# Altium schematic sheet CONTROLLER.SchDoc (part 1 of 2)
size A0
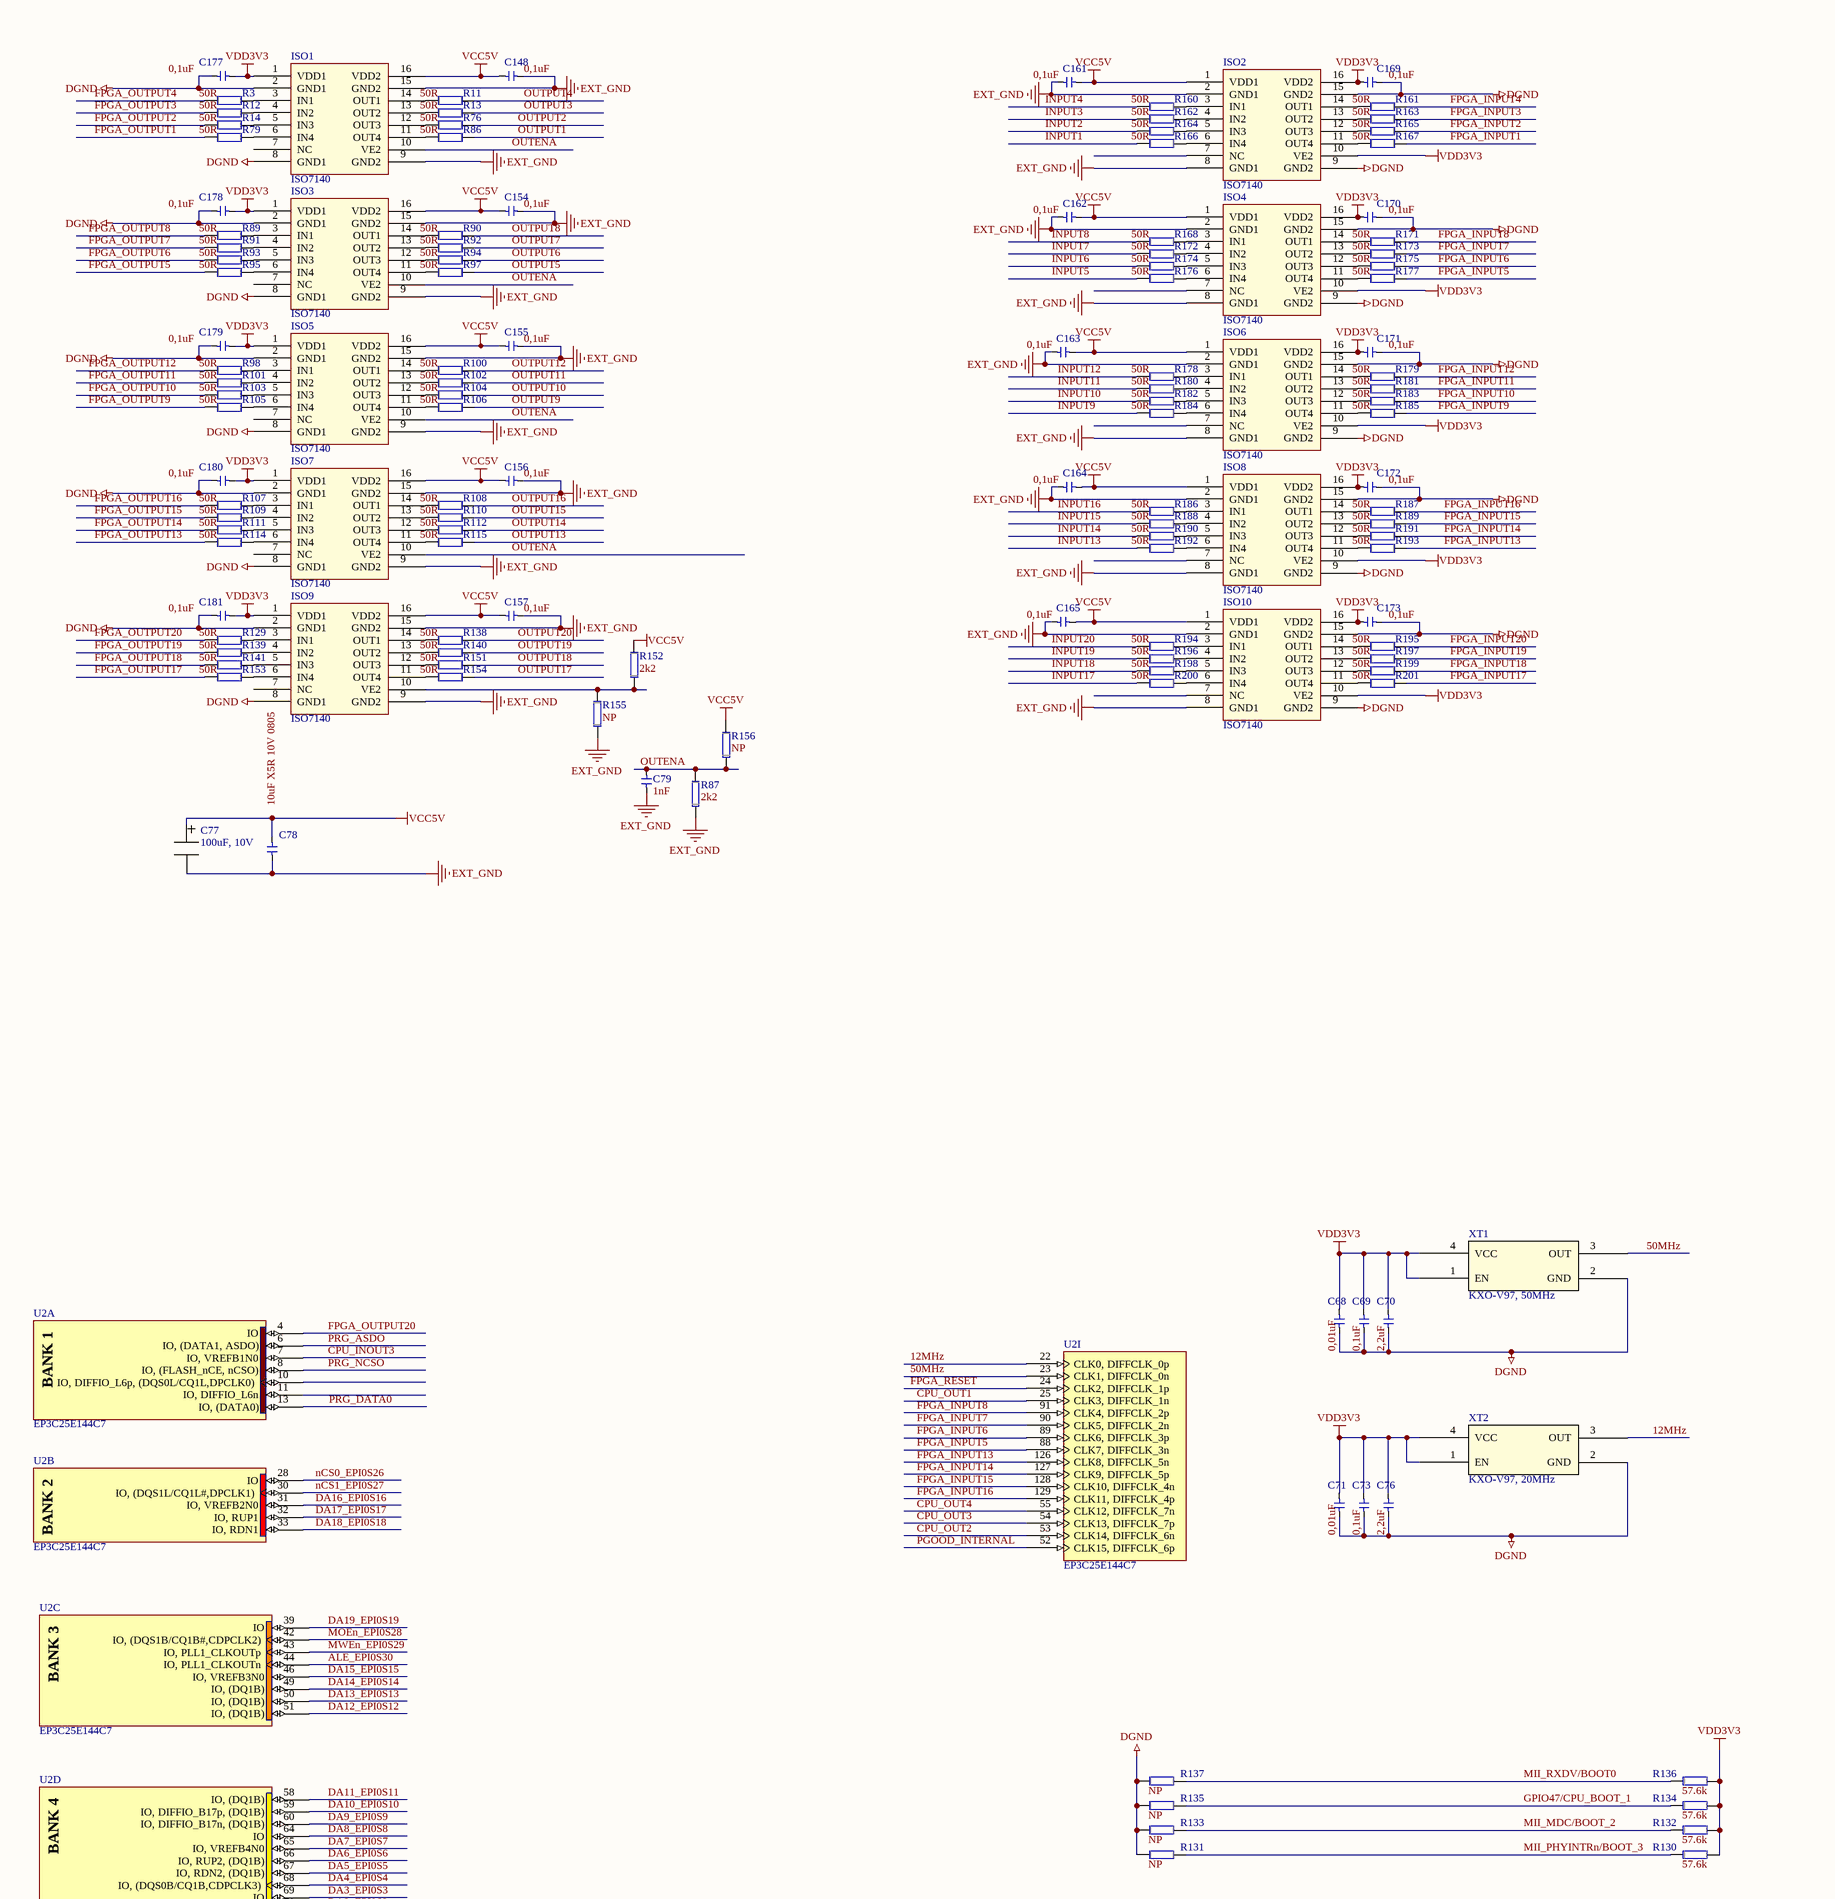
[diagram p0: CONTROLLER.SchDoc, top left]
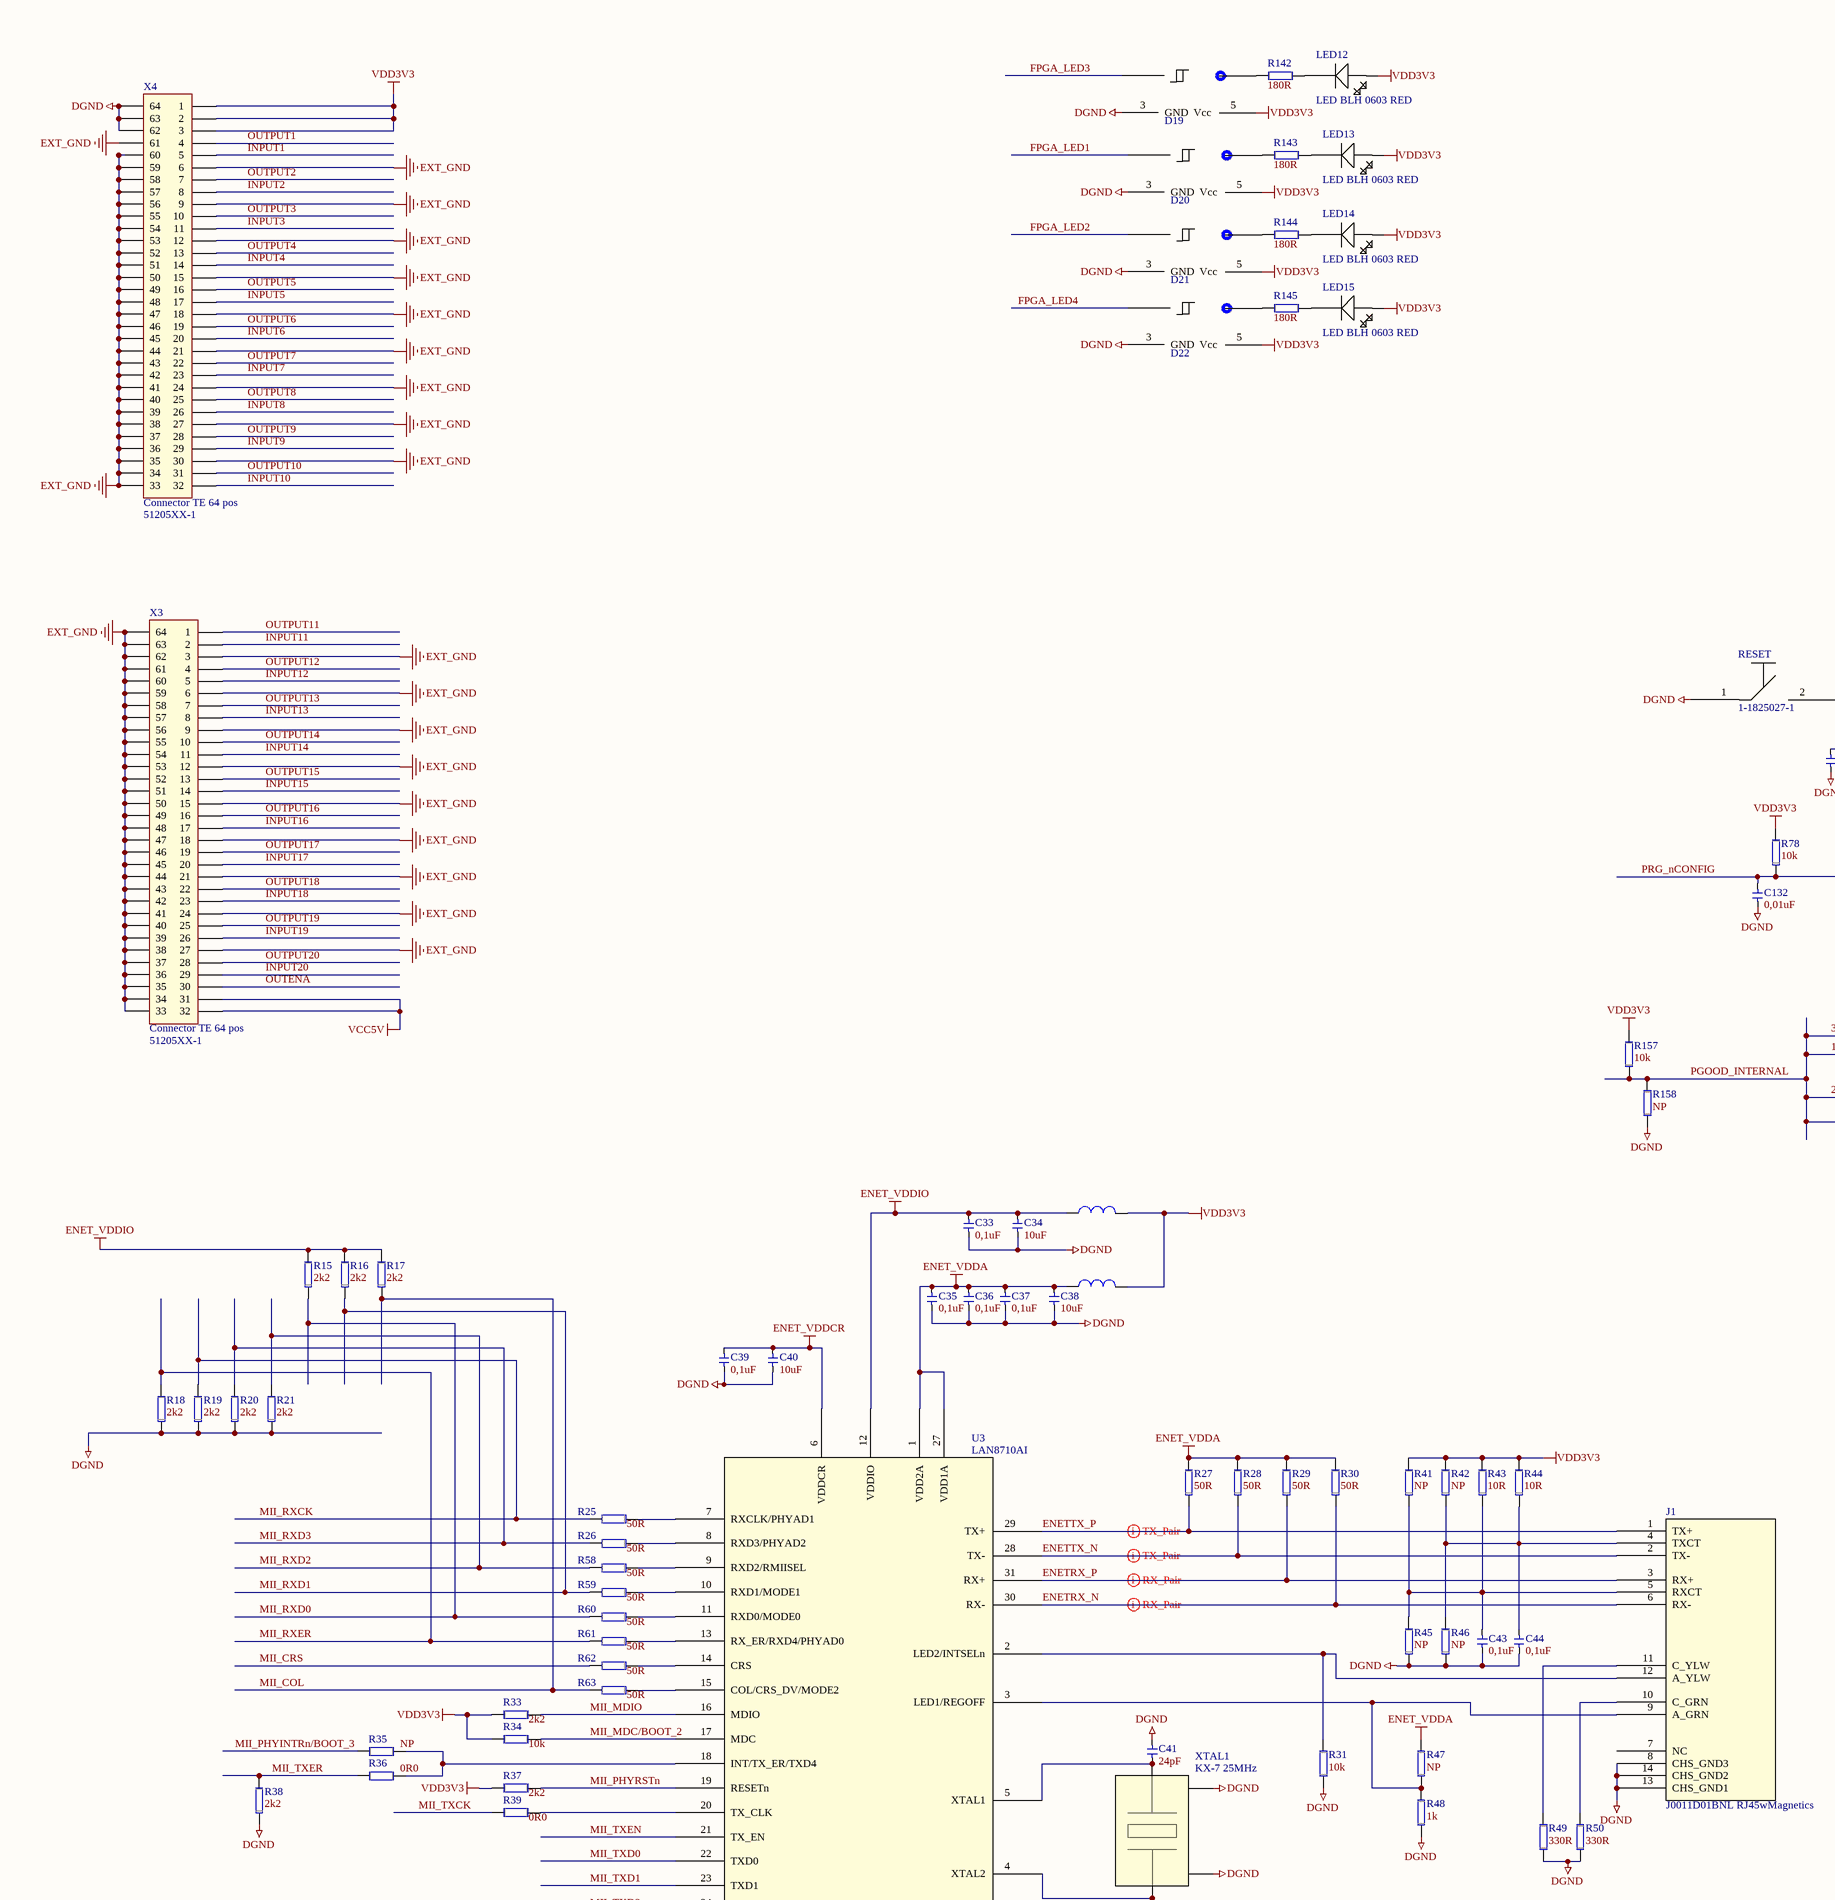
[diagram p1: CONTROLLER.SchDoc, top middle]
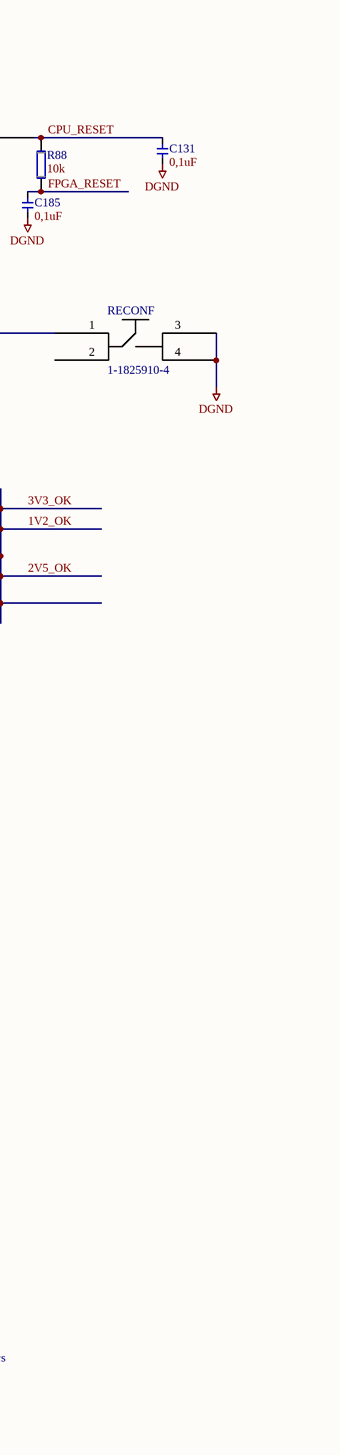
[diagram p2: CONTROLLER.SchDoc, top right]
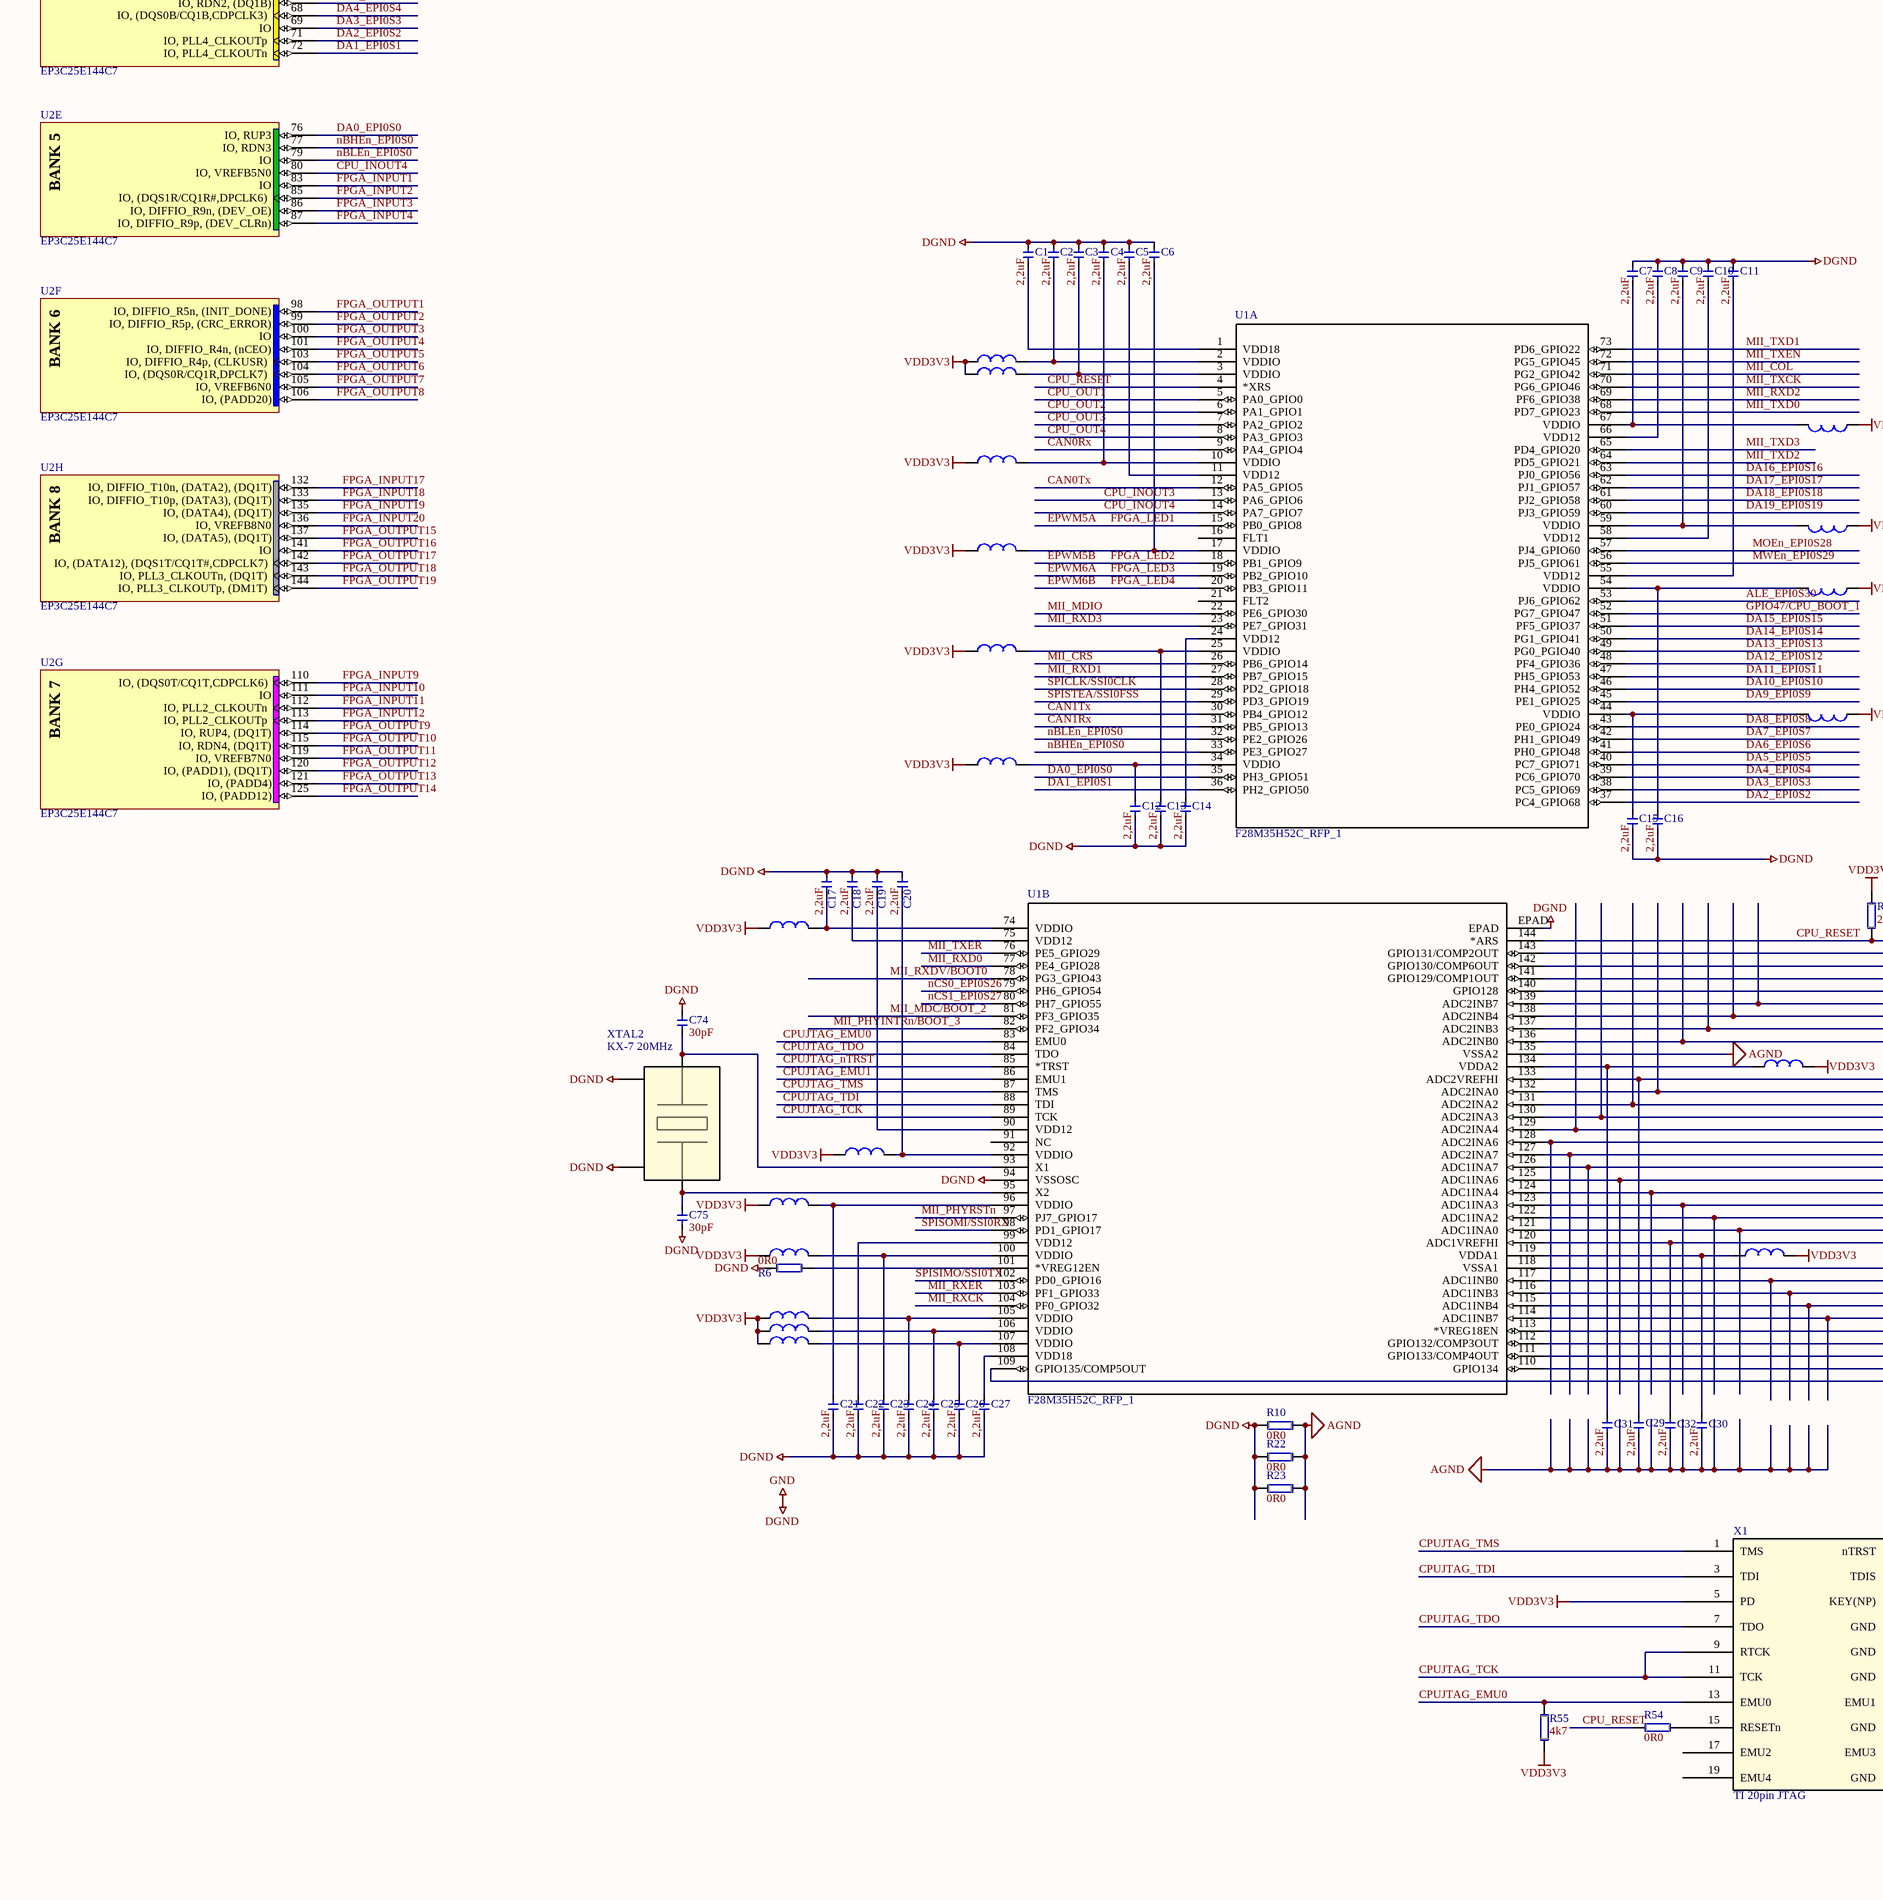
[diagram p3: CONTROLLER.SchDoc, bottom left]
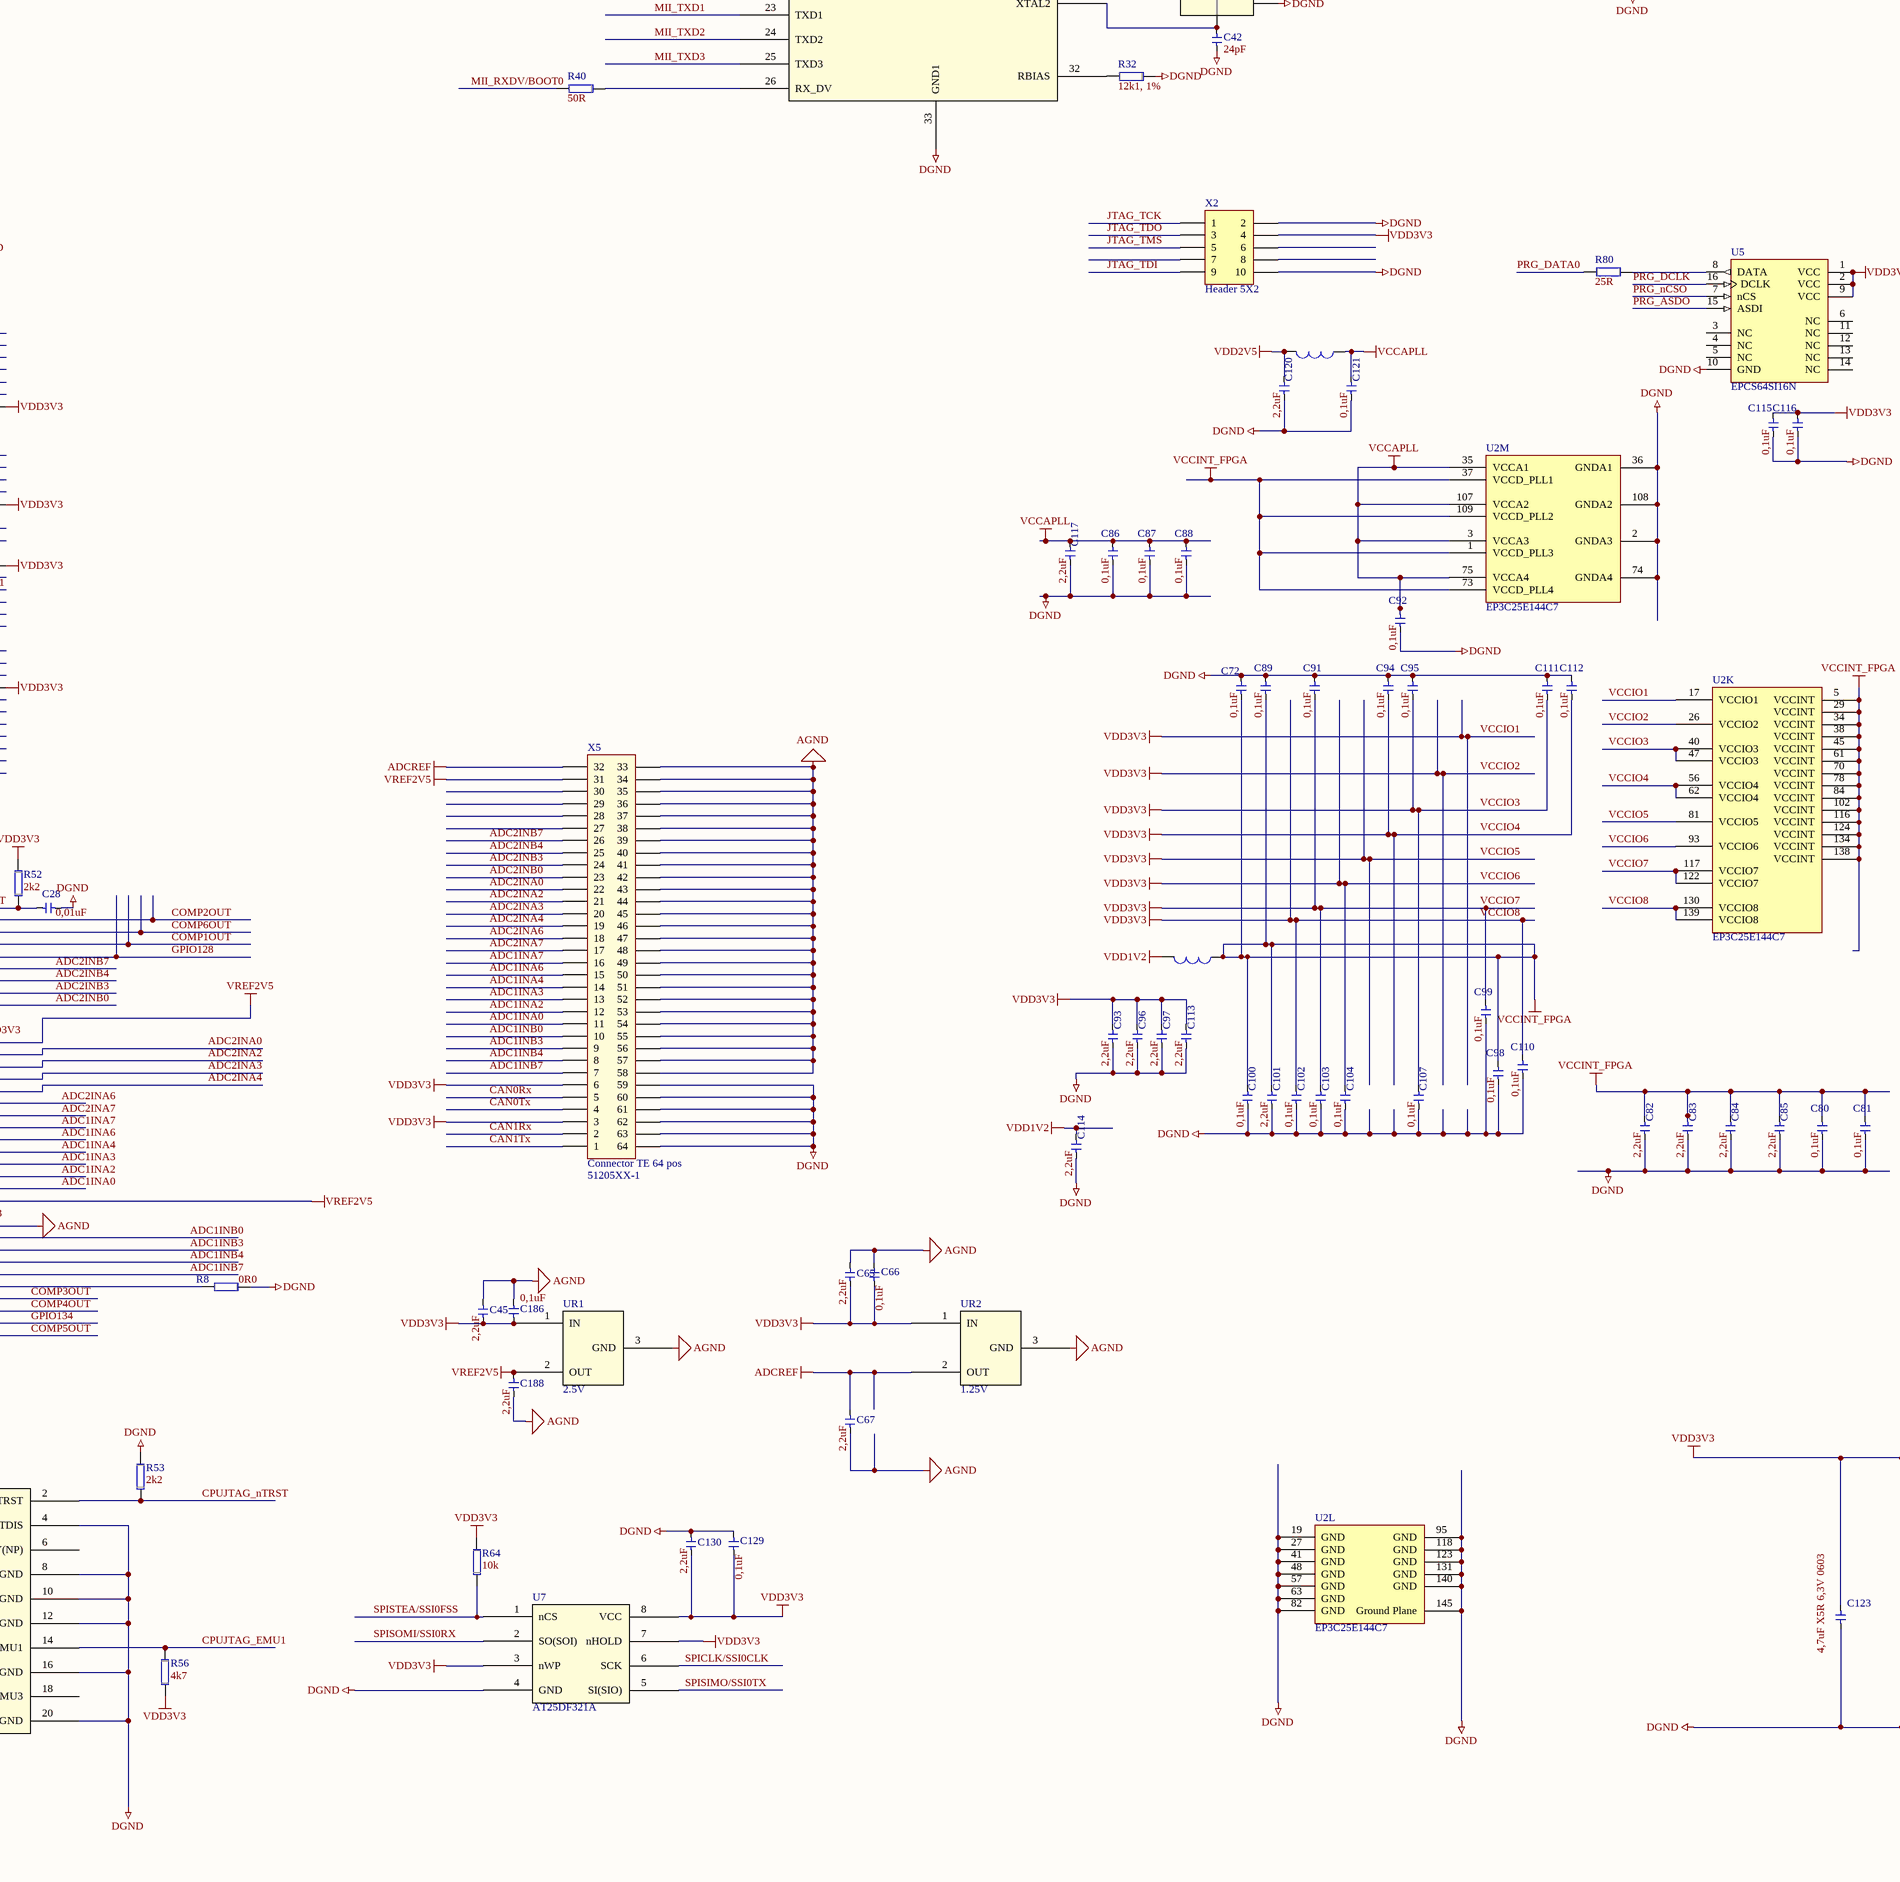
[diagram p4: CONTROLLER.SchDoc, bottom middle]
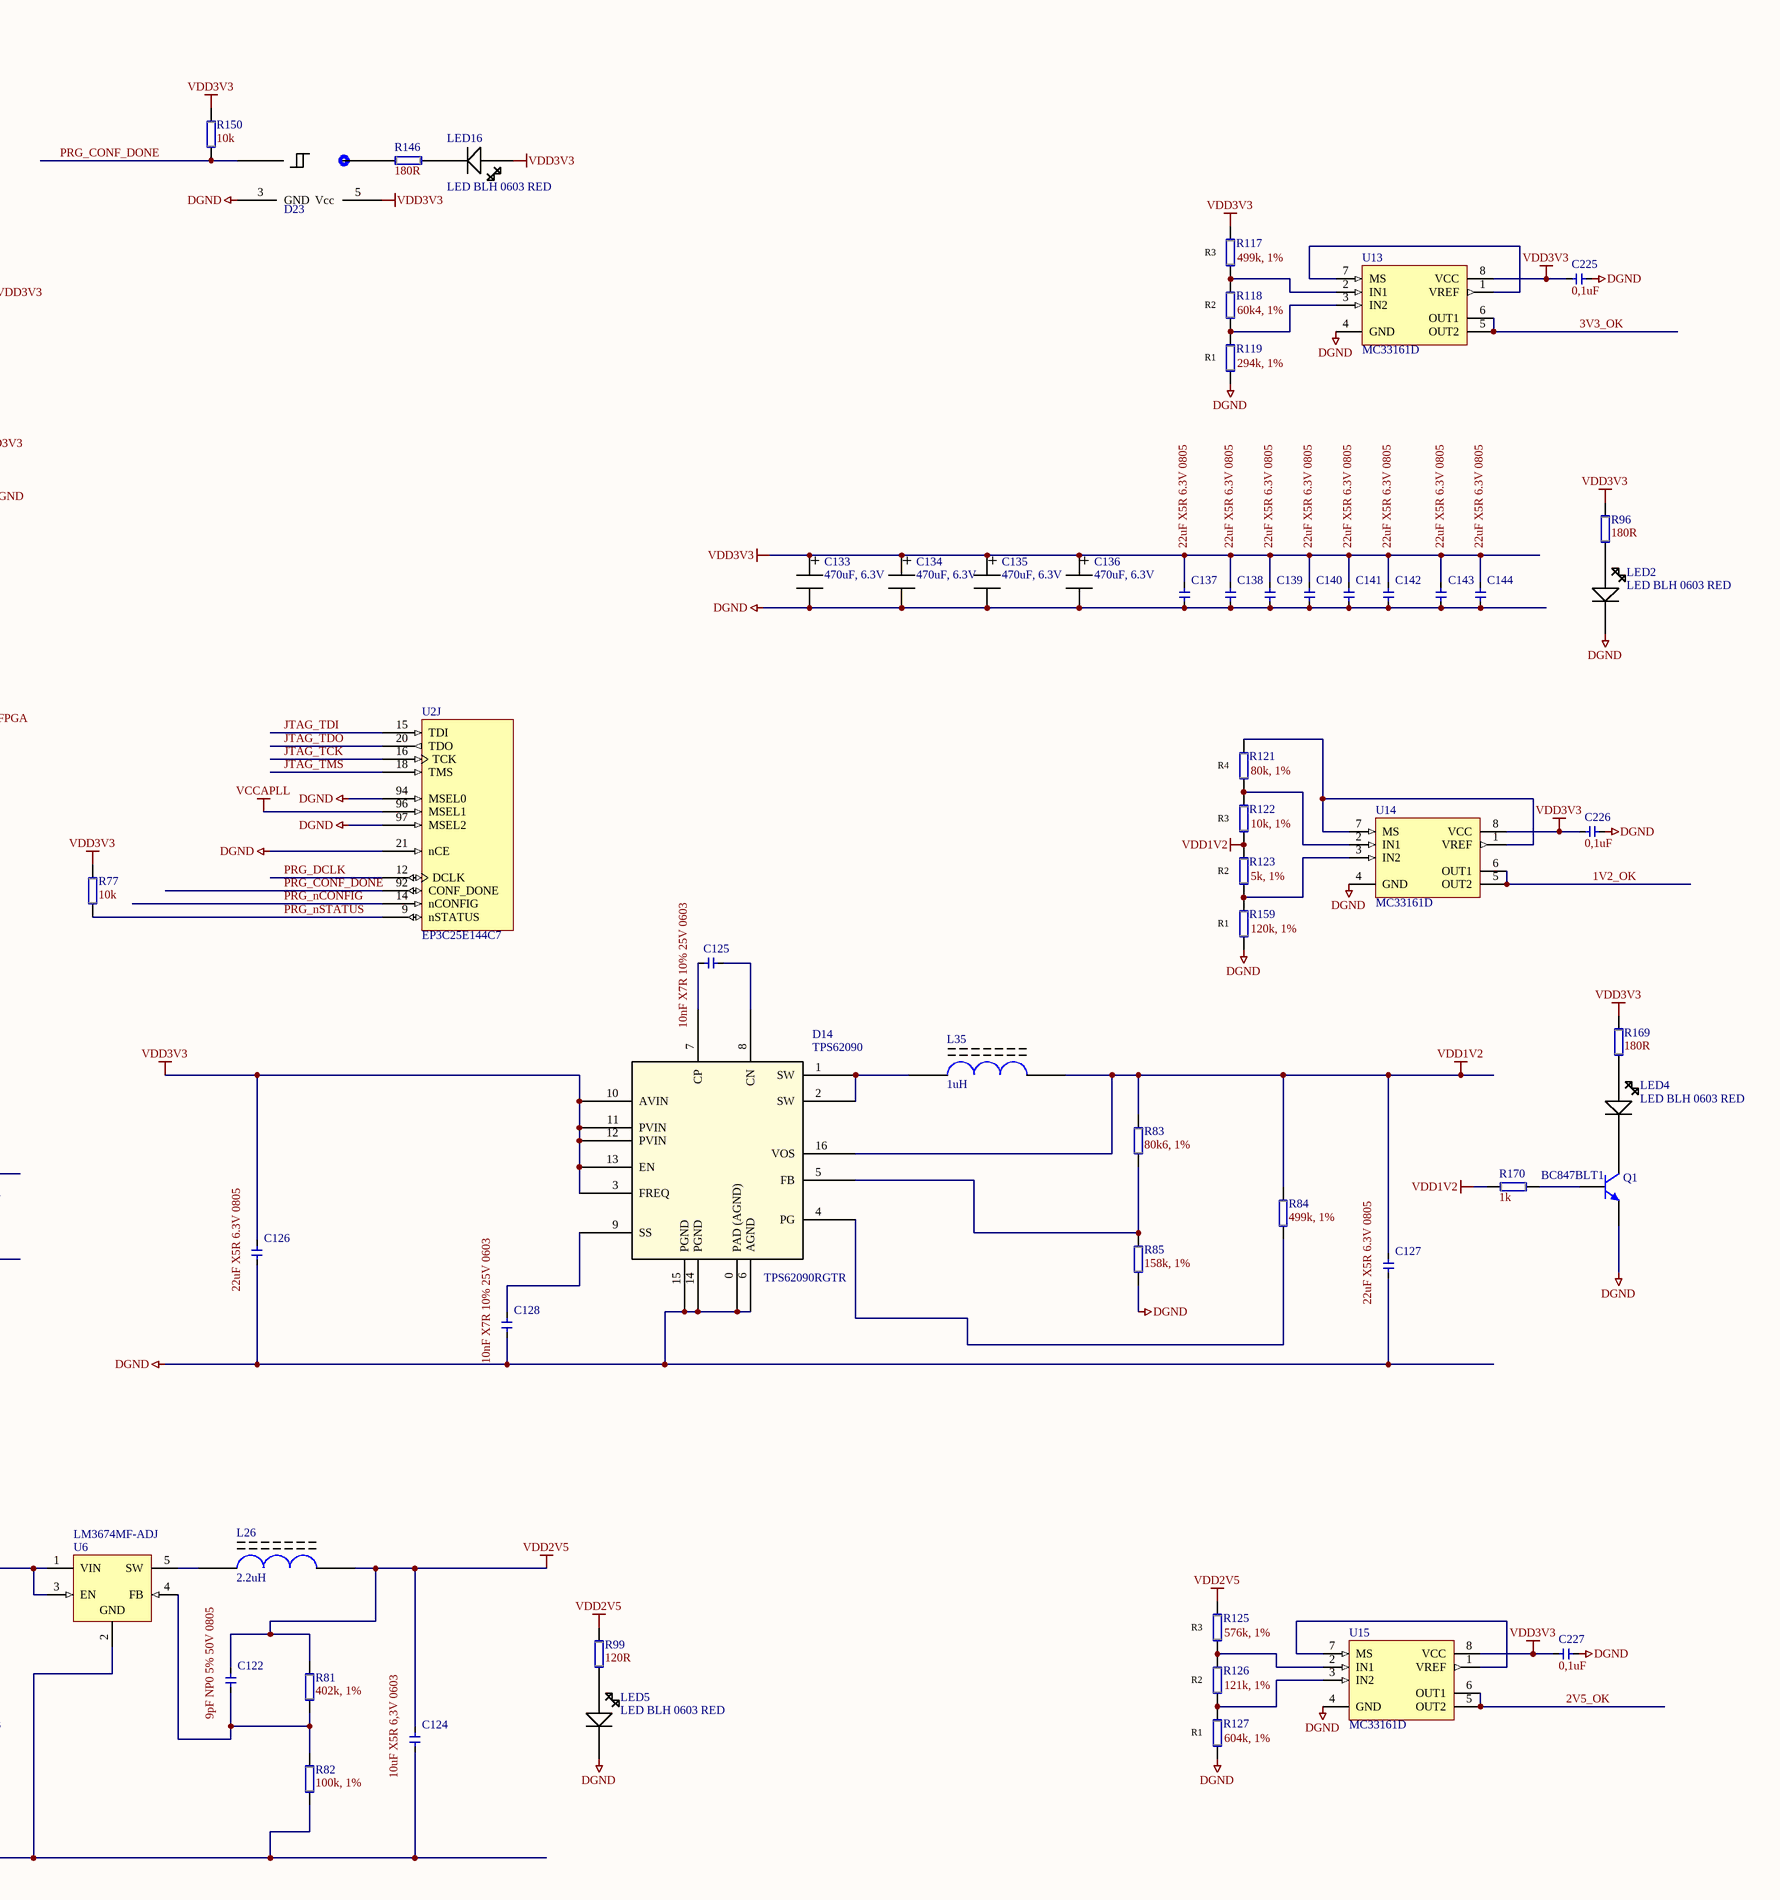
[diagram p5: CONTROLLER.SchDoc, bottom right]

## Parts
C1  value 2,2uF  [SMD CAP 0603]  (hidden comment: ChipCap)
C2  value 2,2uF  [SMD CAP 0603]  (hidden comment: ChipCap)
C3  value 2,2uF  [SMD CAP 0603]  (hidden comment: ChipCap)
C4  value 2,2uF  [SMD CAP 0603]  (hidden comment: ChipCap)
C5  value 2,2uF  [SMD CAP 0603]  (hidden comment: ChipCap)
C6  value 2,2uF  [SMD CAP 0603]  (hidden comment: ChipCap)
C7  value 2,2uF  [SMD CAP 0603]  (hidden comment: ChipCap)
C8  value 2,2uF  [SMD CAP 0603]  (hidden comment: ChipCap)
C9  value 2,2uF  [SMD CAP 0603]  (hidden comment: ChipCap)
C10  value 2,2uF  [SMD CAP 0603]  (hidden comment: ChipCap)
C11  value 2,2uF  [SMD CAP 0603]  (hidden comment: ChipCap)
C12  value 2,2uF  [SMD CAP 0603]  (hidden comment: ChipCap)
C13  value 2,2uF  [SMD CAP 0603]  (hidden comment: ChipCap)
C14  value 2,2uF  [SMD CAP 0603]  (hidden comment: ChipCap)
C15  value 2,2uF  [SMD CAP 0603]  (hidden comment: ChipCap)
C16  value 2,2uF  [SMD CAP 0603]  (hidden comment: ChipCap)
C17  value 2,2uF  [SMD CAP 0603]  (hidden comment: ChipCap)
C18  value 2,2uF  [SMD CAP 0603]  (hidden comment: ChipCap)
C19  value 2,2uF  [SMD CAP 0603]  (hidden comment: ChipCap)
C20  value 2,2uF  [SMD CAP 0603]  (hidden comment: ChipCap)
C21  value 2,2uF  [SMD CAP 0603]  (hidden comment: ChipCap)
C22  value 2,2uF  [SMD CAP 0603]  (hidden comment: ChipCap)
C23  value 2,2uF  [SMD CAP 0603]  (hidden comment: ChipCap)
C24  value 2,2uF  [SMD CAP 0603]  (hidden comment: ChipCap)
C25  value 2,2uF  [SMD CAP 0603]  (hidden comment: ChipCap)
C26  value 2,2uF  [SMD CAP 0603]  (hidden comment: ChipCap)
C27  value 2,2uF  [SMD CAP 0603]  (hidden comment: ChipCap)
C28  value 0,01uF  [SMD CAP 0603]  (hidden comment: ChipCap)
C29  value 2,2uF  [SMD CAP 0603]  (hidden comment: ChipCap)
C30  value 2,2uF  [SMD CAP 0603]  (hidden comment: ChipCap)
C31  value 2,2uF  [SMD CAP 0603]  (hidden comment: ChipCap)
C32  value 2,2uF  [SMD CAP 0603]  (hidden comment: ChipCap)
C33  value 0,1uF  [SMD CAP 0603]  (hidden comment: ChipCap)
C34  value 10uF  [SMD CAP 0805]  (hidden comment: ChipCap)
C35  value 0,1uF  [SMD CAP 0603]  (hidden comment: ChipCap)
C36  value 0,1uF  [SMD CAP 0603]  (hidden comment: ChipCap)
C37  value 0,1uF  [SMD CAP 0603]  (hidden comment: ChipCap)
C38  value 10uF  [SMD CAP 0805]  (hidden comment: ChipCap)
C39  value 0,1uF  [SMD CAP 0603]  (hidden comment: ChipCap)
C40  value 10uF  [SMD CAP 0805]  (hidden comment: ChipCap)
C41  value 24pF  [SMD CAP 0603]  (hidden comment: ChipCap)
C42  value 24pF  [SMD CAP 0603]  (hidden comment: ChipCap)
C43  value 0,1uF  [SMD CAP 0603]  (hidden comment: ChipCap)
C44  value 0,1uF  [SMD CAP 0603]  (hidden comment: ChipCap)
C45  value 2,2uF  [SMD CAP 0603]  (hidden comment: ChipCap)
C65  value 2,2uF  [SMD CAP 0603]  (hidden comment: ChipCap)
C66  value 0,1uF  [SMD CAP 0603]  (hidden comment: ChipCap)
C67  value 2,2uF  [SMD CAP 0603]  (hidden comment: ChipCap)
C68  value 0,01uF  [SMD CAP 0603]  (hidden comment: ChipCap)
C69  value 0,1uF  [SMD CAP 0603]  (hidden comment: ChipCap)
C70  value 2,2uF  [SMD CAP 0603]  (hidden comment: ChipCap)
C71  value 0,01uF  [SMD CAP 0603]  (hidden comment: ChipCap)
C72  value 0,1uF  [SMD CAP 0603]  (hidden comment: ChipCap)
C73  value 0,1uF  [SMD CAP 0603]  (hidden comment: ChipCap)
C74  value 30pF  [SMD CAP 0603]  (hidden comment: ChipCap)
C75  value 30pF  [SMD CAP 0603]  (hidden comment: ChipCap)
C76  value 2,2uF  [SMD CAP 0603]  (hidden comment: ChipCap)
C77  value 100uF, 10V  [D]  (hidden comment: Tant Cap D-case)
C78  value 10uF X5R 10V 0805  [SMD CAP 0805]  (hidden comment: ChipCap)
C79  value 1nF  [SMD CAP 0603]  (hidden comment: ChipCap)
C80  value 0,1uF  [SMD CAP 0603]  (hidden comment: ChipCap)
C81  value 0,1uF  [SMD CAP 0603]  (hidden comment: ChipCap)
C82  value 2,2uF  [SMD CAP 0603]  (hidden comment: ChipCap)
C83  value 2,2uF  [SMD CAP 0603]  (hidden comment: ChipCap)
C84  value 2,2uF  [SMD CAP 0603]  (hidden comment: ChipCap)
C85  value 2,2uF  [SMD CAP 0603]  (hidden comment: ChipCap)
C86  value 0,1uF  [SMD CAP 0603]  (hidden comment: ChipCap)
C87  value 0,1uF  [SMD CAP 0603]  (hidden comment: ChipCap)
C88  value 0,1uF  [SMD CAP 0603]  (hidden comment: ChipCap)
C89  value 0,1uF  [SMD CAP 0603]  (hidden comment: ChipCap)
C91  value 0,1uF  [SMD CAP 0603]  (hidden comment: ChipCap)
C92  value 0,1uF  [SMD CAP 0603]  (hidden comment: ChipCap)
C93  value 2,2uF  [SMD CAP 0603]  (hidden comment: ChipCap)
C94  value 0,1uF  [SMD CAP 0603]  (hidden comment: ChipCap)
C95  value 0,1uF  [SMD CAP 0603]  (hidden comment: ChipCap)
C96  value 2,2uF  [SMD CAP 0603]  (hidden comment: ChipCap)
C97  value 2,2uF  [SMD CAP 0603]  (hidden comment: ChipCap)
C98  value 0,1uF  [SMD CAP 0603]  (hidden comment: ChipCap)
C99  value 0,1uF  [SMD CAP 0603]  (hidden comment: ChipCap)
C100  value 0,1uF  [SMD CAP 0603]  (hidden comment: ChipCap)
C101  value 2,2uF  [SMD CAP 0603]  (hidden comment: ChipCap)
C102  value 0,1uF  [SMD CAP 0603]  (hidden comment: ChipCap)
C103  value 0,1uF  [SMD CAP 0603]  (hidden comment: ChipCap)
C104  value 0,1uF  [SMD CAP 0603]  (hidden comment: ChipCap)
C107  value 0,1uF  [SMD CAP 0603]  (hidden comment: ChipCap)
C110  value 0,1uF  [SMD CAP 0603]  (hidden comment: ChipCap)
C111  value 0,1uF  [SMD CAP 0603]  (hidden comment: ChipCap)
C112  value 0,1uF  [SMD CAP 0603]  (hidden comment: ChipCap)
C113  value 2,2uF  [SMD CAP 0603]  (hidden comment: ChipCap)
C114  value 2,2uF  [SMD CAP 0603]  (hidden comment: ChipCap)
C115  value 0,1uF  [SMD CAP 0603]  (hidden comment: ChipCap)
C116  value 0,1uF  [SMD CAP 0603]  (hidden comment: ChipCap)
C117  value 2,2uF  [SMD CAP 0603]  (hidden comment: ChipCap)
C120  value 2,2uF  [SMD CAP 0603]  (hidden comment: ChipCap)
C121  value 0,1uF  [SMD CAP 0603]  (hidden comment: ChipCap)
C122  value 9pF NP0 5% 50V 0805  [SMD CAP 0805]  (hidden comment: ChipCap)
C123  value 4,7uF X5R 6,3V 0603  [SMD CAP 0603]  (hidden comment: ChipCap)
C124  value 10uF X5R 6,3V 0603  [SMD CAP 0603]  (hidden comment: ChipCap)
C125  value 10nF X7R 10% 25V 0603  [SMD CAP 0603]  (hidden comment: ChipCap)
C126  value 22uF X5R 6.3V 0805  [SMD CAP 0805]  (hidden comment: ChipCap)
C127  value 22uF X5R 6.3V 0805  [SMD CAP 0805]  (hidden comment: ChipCap)
C128  value 10nF X7R 10% 25V 0603  [SMD CAP 0603]  (hidden comment: ChipCap)
C129  value 0,1uF  [SMD CAP 0603]  (hidden comment: ChipCap)
C130  value 2,2uF  [SMD CAP 0603]  (hidden comment: ChipCap)
C131  value 0,1uF  [SMD CAP 0603]  (hidden comment: ChipCap)
C132  value 0,01uF  [SMD CAP 0603]  (hidden comment: ChipCap)
C133  value 470uF, 6.3V  [D]  (hidden comment: Tant Cap D-case)
C134  value 470uF, 6.3V  [D]  (hidden comment: Tant Cap D-case)
C135  value 470uF, 6.3V  [D]  (hidden comment: Tant Cap D-case)
C136  value 470uF, 6.3V  [D]  (hidden comment: Tant Cap D-case)
C137  value 22uF X5R 6.3V 0805  [SMD CAP 0805]  (hidden comment: ChipCap)
C138  value 22uF X5R 6.3V 0805  [SMD CAP 0805]  (hidden comment: ChipCap)
C139  value 22uF X5R 6.3V 0805  [SMD CAP 0805]  (hidden comment: ChipCap)
C140  value 22uF X5R 6.3V 0805  [SMD CAP 0805]  (hidden comment: ChipCap)
C141  value 22uF X5R 6.3V 0805  [SMD CAP 0805]  (hidden comment: ChipCap)
C142  value 22uF X5R 6.3V 0805  [SMD CAP 0805]  (hidden comment: ChipCap)
C143  value 22uF X5R 6.3V 0805  [SMD CAP 0805]  (hidden comment: ChipCap)
C144  value 22uF X5R 6.3V 0805  [SMD CAP 0805]  (hidden comment: ChipCap)
C148  value 0,1uF  [SMD CAP 0603]  (hidden comment: ChipCap)
C154  value 0,1uF  [SMD CAP 0603]  (hidden comment: ChipCap)
C155  value 0,1uF  [SMD CAP 0603]  (hidden comment: ChipCap)
C156  value 0,1uF  [SMD CAP 0603]  (hidden comment: ChipCap)
C157  value 0,1uF  [SMD CAP 0603]  (hidden comment: ChipCap)
C161  value 0,1uF  [SMD CAP 0603]  (hidden comment: ChipCap)
C162  value 0,1uF  [SMD CAP 0603]  (hidden comment: ChipCap)
C163  value 0,1uF  [SMD CAP 0603]  (hidden comment: ChipCap)
C164  value 0,1uF  [SMD CAP 0603]  (hidden comment: ChipCap)
C165  value 0,1uF  [SMD CAP 0603]  (hidden comment: ChipCap)
C169  value 0,1uF  [SMD CAP 0603]  (hidden comment: ChipCap)
C170  value 0,1uF  [SMD CAP 0603]  (hidden comment: ChipCap)
C171  value 0,1uF  [SMD CAP 0603]  (hidden comment: ChipCap)
C172  value 0,1uF  [SMD CAP 0603]  (hidden comment: ChipCap)
C173  value 0,1uF  [SMD CAP 0603]  (hidden comment: ChipCap)
C177  value 0,1uF  [SMD CAP 0603]  (hidden comment: ChipCap)
C178  value 0,1uF  [SMD CAP 0603]  (hidden comment: ChipCap)
C179  value 0,1uF  [SMD CAP 0603]  (hidden comment: ChipCap)
C180  value 0,1uF  [SMD CAP 0603]  (hidden comment: ChipCap)
C181  value 0,1uF  [SMD CAP 0603]  (hidden comment: ChipCap)
C185  value 0,1uF  [SMD CAP 0603]  (hidden comment: ChipCap)
C186  value 0,1uF  [SMD CAP 0603]  (hidden comment: ChipCap)
C188  value 2,2uF  [SMD CAP 0603]  (hidden comment: ChipCap)
C225  value 0,1uF  [SMD CAP 0603]  (hidden comment: ChipCap)
C226  value 0,1uF  [SMD CAP 0603]  (hidden comment: ChipCap)
C227  value 0,1uF  [SMD CAP 0603]  (hidden comment: ChipCap)
D14  TPS62090  value TPS62090RGTR  [QFN50P300X300X100-16N]
D19  Inverted Schmitt Trigger  [TI-SOT23 SOT95P280X145-5N]  (value not drawn)
D20  Inverted Schmitt Trigger  [TI-SOT23 SOT95P280X145-5N]  (value not drawn)
D21  Inverted Schmitt Trigger  [TI-SOT23 SOT95P280X145-5N]  (value not drawn)
D22  Inverted Schmitt Trigger  [TI-SOT23 SOT95P280X145-5N]  (value not drawn)
D23  Inverted Schmitt Trigger  [TI-SOT23 SOT95P280X145-5N]  (value not drawn)
ISO1  value ISO7140  [DBQ016]  (hidden comment: ISO7140 Isolator)
ISO2  value ISO7140  [DBQ016]  (hidden comment: ISO7140 Isolator)
ISO3  value ISO7140  [DBQ016]  (hidden comment: ISO7140 Isolator)
ISO4  value ISO7140  [DBQ016]  (hidden comment: ISO7140 Isolator)
ISO5  value ISO7140  [DBQ016]  (hidden comment: ISO7140 Isolator)
ISO6  value ISO7140  [DBQ016]  (hidden comment: ISO7140 Isolator)
ISO7  value ISO7140  [DBQ016]  (hidden comment: ISO7140 Isolator)
ISO8  value ISO7140  [DBQ016]  (hidden comment: ISO7140 Isolator)
ISO9  value ISO7140  [DBQ016]  (hidden comment: ISO7140 Isolator)
ISO10  value ISO7140  [DBQ016]  (hidden comment: ISO7140 Isolator)
J1  J0011D01BNL RJ45wMagnetics  [J0011D01BNL]
L1  LQM21  [SMD IND 0805]  (value not drawn)
L2  LQM21  [SMD IND 0805]  (value not drawn)
L3  LQM21  [SMD IND 0805]  (value not drawn)
L4  LQM21  [SMD IND 0805]  (value not drawn)
L5  LQM21  [SMD IND 0805]  (value not drawn)
L6  LQM21  [SMD IND 0805]  (value not drawn)
L8  LQM21  [SMD IND 0805]  (value not drawn)
L9  LQM21  [SMD IND 0805]  (value not drawn)
L10  LQM21  [SMD IND 0805]  (value not drawn)
L11  LQM21  [SMD IND 0805]  (value not drawn)
L12  LQM21  [SMD IND 0805]  (value not drawn)
L13  LQM21  [SMD IND 0805]  (value not drawn)
L14  LQM21  [SMD IND 0805]  (value not drawn)
L15  LQM21  [SMD IND 0805]  (value not drawn)
L16  LQM21  [SMD IND 0805]  (value not drawn)
L17  LQM21  [SMD IND 0805]  (value not drawn)
L18  LQM21  [SMD IND 0805]  (value not drawn)
L19  LQM21  [SMD IND 0805]  (value not drawn)
L20  LQM21  [SMD IND 0805]  (value not drawn)
L21  LQM21  [SMD IND 0805]  (value not drawn)
L22  LQM21  [SMD IND 0805]  (value not drawn)
L25  LQM21  [SMD IND 0805]  (value not drawn)
L26  value 2.2uH  [CDRH2D14 IND]  (hidden comment: CDRH2D14)
L35  value 1uH  [INDC6363X50N LQH66S]  (hidden comment: LQH66S)
L36  LQM21  [SMD IND 0805]  (value not drawn)
LED2  value LED BLH 0603 RED  [1206 LED]  (hidden comment: LED BLH)
LED4  value LED BLH 0603 RED  [1206 LED]  (hidden comment: LED BLH)
LED5  value LED BLH 0603 RED  [1206 LED]  (hidden comment: LED BLH)
LED12  value LED BLH 0603 RED  [1206 LED]  (hidden comment: LED BLH)
LED13  value LED BLH 0603 RED  [1206 LED]  (hidden comment: LED BLH)
LED14  value LED BLH 0603 RED  [1206 LED]  (hidden comment: LED BLH)
LED15  value LED BLH 0603 RED  [1206 LED]  (hidden comment: LED BLH)
LED16  value LED BLH 0603 RED  [1206 LED]  (hidden comment: LED BLH)
Q1  BC847BLT1  [318-08]
R3  value 50R  [SMD RES 0603]  (hidden comment: Rsize)
R6  value 0R0  [SMD RES 0603]  (hidden comment: Rsize)
R8  value 0R0  [SMD RES 0603]  (hidden comment: Rsize)
R10  value 0R0  [SMD RES 0603]  (hidden comment: Rsize)
R11  value 50R  [SMD RES 0603]  (hidden comment: Rsize)
R12  value 50R  [SMD RES 0603]  (hidden comment: Rsize)
R13  value 50R  [SMD RES 0603]  (hidden comment: Rsize)
R14  value 50R  [SMD RES 0603]  (hidden comment: Rsize)
R15  value 2k2  [SMD RES 0603]  (hidden comment: Rsize)
R16  value 2k2  [SMD RES 0603]  (hidden comment: Rsize)
R17  value 2k2  [SMD RES 0603]  (hidden comment: Rsize)
R18  value 2k2  [SMD RES 0603]  (hidden comment: Rsize)
R19  value 2k2  [SMD RES 0603]  (hidden comment: Rsize)
R20  value 2k2  [SMD RES 0603]  (hidden comment: Rsize)
R21  value 2k2  [SMD RES 0603]  (hidden comment: Rsize)
R22  value 0R0  [SMD RES 0603]  (hidden comment: Rsize)
R23  value 0R0  [SMD RES 0603]  (hidden comment: Rsize)
R25  value 50R  [SMD RES 0603]  (hidden comment: Rsize)
R26  value 50R  [SMD RES 0603]  (hidden comment: Rsize)
R27  value 50R  [SMD RES 0603]  (hidden comment: Rsize)
R28  value 50R  [SMD RES 0603]  (hidden comment: Rsize)
R29  value 50R  [SMD RES 0603]  (hidden comment: Rsize)
R30  value 50R  [SMD RES 0603]  (hidden comment: Rsize)
R31  value 10k  [SMD RES 0603]  (hidden comment: Rsize)
R32  value 12k1, 1%  [SMD RES 0603]  (hidden comment: Rsize)
R33  value 2k2  [SMD RES 0603]  (hidden comment: Rsize)
R34  value 10k  [SMD RES 0603]  (hidden comment: Rsize)
R35  value NP  [SMD RES 0603]  (hidden comment: Rsize)
R36  value 0R0  [SMD RES 0603]  (hidden comment: Rsize)
R37  value 2k2  [SMD RES 0603]  (hidden comment: Rsize)
R38  value 2k2  [SMD RES 0603]  (hidden comment: Rsize)
R39  value 0R0  [SMD RES 0603]  (hidden comment: Rsize)
R40  value 50R  [SMD RES 0603]  (hidden comment: Rsize)
R41  value NP  [SMD RES 0603]  (hidden comment: Rsize)
R42  value NP  [SMD RES 0603]  (hidden comment: Rsize)
R43  value 10R  [SMD RES 0603]  (hidden comment: Rsize)
R44  value 10R  [SMD RES 0603]  (hidden comment: Rsize)
R45  value NP  [SMD RES 0603]  (hidden comment: Rsize)
R46  value NP  [SMD RES 0603]  (hidden comment: Rsize)
R47  value NP  [SMD RES 0603]  (hidden comment: Rsize)
R48  value 1k  [SMD RES 0603]  (hidden comment: Rsize)
R49  value 330R  [SMD RES 0603]  (hidden comment: Rsize)
R50  value 330R  [SMD RES 0603]  (hidden comment: Rsize)
R52  value 2k2  [SMD RES 0603]  (hidden comment: Rsize)
R53  value 2k2  [SMD RES 0603]  (hidden comment: Rsize)
R54  value 0R0  [SMD RES 0603]  (hidden comment: Rsize)
R55  value 4k7  [SMD RES 0603]  (hidden comment: Rsize)
R56  value 4k7  [SMD RES 0603]  (hidden comment: Rsize)
R58  value 50R  [SMD RES 0603]  (hidden comment: Rsize)
R59  value 50R  [SMD RES 0603]  (hidden comment: Rsize)
R60  value 50R  [SMD RES 0603]  (hidden comment: Rsize)
R61  value 50R  [SMD RES 0603]  (hidden comment: Rsize)
R62  value 50R  [SMD RES 0603]  (hidden comment: Rsize)
R63  value 50R  [SMD RES 0603]  (hidden comment: Rsize)
R64  value 10k  [SMD RES 0603]  (hidden comment: Rsize)
R76  value 50R  [SMD RES 0603]  (hidden comment: Rsize)
R77  value 10k  [SMD RES 0603]  (hidden comment: Rsize)
R78  value 10k  [SMD RES 0603]  (hidden comment: Rsize)
R79  value 50R  [SMD RES 0603]  (hidden comment: Rsize)
R80  value 25R  [SMD RES 0603]  (hidden comment: Rsize)
R81  value 402k, 1%  [SMD RES 0603]  (hidden comment: Rsize)
R82  value 100k, 1%  [SMD RES 0603]  (hidden comment: Rsize)
R83  value 80k6, 1%  [SMD RES 0603]  (hidden comment: Rsize)
R84  value 499k, 1%  [SMD RES 0603]  (hidden comment: Rsize)
R85  value 158k, 1%  [SMD RES 0603]  (hidden comment: Rsize)
R86  value 50R  [SMD RES 0603]  (hidden comment: Rsize)
R87  value 2k2  [SMD RES 0603]  (hidden comment: Rsize)
R88  value 10k  [SMD RES 0603]  (hidden comment: Rsize)
R89  value 50R  [SMD RES 0603]  (hidden comment: Rsize)
R90  value 50R  [SMD RES 0603]  (hidden comment: Rsize)
R91  value 50R  [SMD RES 0603]  (hidden comment: Rsize)
R92  value 50R  [SMD RES 0603]  (hidden comment: Rsize)
R93  value 50R  [SMD RES 0603]  (hidden comment: Rsize)
R94  value 50R  [SMD RES 0603]  (hidden comment: Rsize)
R95  value 50R  [SMD RES 0603]  (hidden comment: Rsize)
R96  value 180R  [SMD RES 0603]  (hidden comment: Rsize)
R97  value 50R  [SMD RES 0603]  (hidden comment: Rsize)
R98  value 50R  [SMD RES 0603]  (hidden comment: Rsize)
R99  value 120R  [SMD RES 0603]  (hidden comment: Rsize)
R100  value 50R  [SMD RES 0603]  (hidden comment: Rsize)
R101  value 50R  [SMD RES 0603]  (hidden comment: Rsize)
R102  value 50R  [SMD RES 0603]  (hidden comment: Rsize)
R103  value 50R  [SMD RES 0603]  (hidden comment: Rsize)
R104  value 50R  [SMD RES 0603]  (hidden comment: Rsize)
R105  value 50R  [SMD RES 0603]  (hidden comment: Rsize)
R106  value 50R  [SMD RES 0603]  (hidden comment: Rsize)
R107  value 50R  [SMD RES 0603]  (hidden comment: Rsize)
R108  value 50R  [SMD RES 0603]  (hidden comment: Rsize)
R109  value 50R  [SMD RES 0603]  (hidden comment: Rsize)
R110  value 50R  [SMD RES 0603]  (hidden comment: Rsize)
R111  value 50R  [SMD RES 0603]  (hidden comment: Rsize)
R112  value 50R  [SMD RES 0603]  (hidden comment: Rsize)
R114  value 50R  [SMD RES 0603]  (hidden comment: Rsize)
R115  value 50R  [SMD RES 0603]  (hidden comment: Rsize)
R117  value 499k, 1%  [SMD RES 0603]  (hidden comment: Rsize)
R118  value 60k4, 1%  [SMD RES 0603]  (hidden comment: Rsize)
R119  value 294k, 1%  [SMD RES 0603]  (hidden comment: Rsize)
R121  value 80k, 1%  [SMD RES 0603]  (hidden comment: Rsize)
R122  value 10k, 1%  [SMD RES 0603]  (hidden comment: Rsize)
R123  value 5k, 1%  [SMD RES 0603]  (hidden comment: Rsize)
R125  value 576k, 1%  [SMD RES 0603]  (hidden comment: Rsize)
R126  value 121k, 1%  [SMD RES 0603]  (hidden comment: Rsize)
R127  value 604k, 1%  [SMD RES 0603]  (hidden comment: Rsize)
R129  value 50R  [SMD RES 0603]  (hidden comment: Rsize)
R130  value 57.6k  [SMD RES 0603]  (hidden comment: Rsize)
R131  value NP  [SMD RES 0603]  (hidden comment: Rsize)
R132  value 57.6k  [SMD RES 0603]  (hidden comment: Rsize)
R133  value NP  [SMD RES 0603]  (hidden comment: Rsize)
R134  value 57.6k  [SMD RES 0603]  (hidden comment: Rsize)
R135  value NP  [SMD RES 0603]  (hidden comment: Rsize)
R136  value 57.6k  [SMD RES 0603]  (hidden comment: Rsize)
R137  value NP  [SMD RES 0603]  (hidden comment: Rsize)
R138  value 50R  [SMD RES 0603]  (hidden comment: Rsize)
R139  value 50R  [SMD RES 0603]  (hidden comment: Rsize)
R140  value 50R  [SMD RES 0603]  (hidden comment: Rsize)
R141  value 50R  [SMD RES 0603]  (hidden comment: Rsize)
R142  value 180R  [SMD RES 0603]  (hidden comment: Rsize)
R143  value 180R  [SMD RES 0603]  (hidden comment: Rsize)
R144  value 180R  [SMD RES 0603]  (hidden comment: Rsize)
R145  value 180R  [SMD RES 0603]  (hidden comment: Rsize)
R146  value 180R  [SMD RES 0603]  (hidden comment: Rsize)
R150  value 10k  [SMD RES 0603]  (hidden comment: Rsize)
R151  value 50R  [SMD RES 0603]  (hidden comment: Rsize)
R152  value 2k2  [SMD RES 0603]  (hidden comment: Rsize)
R153  value 50R  [SMD RES 0603]  (hidden comment: Rsize)
R154  value 50R  [SMD RES 0603]  (hidden comment: Rsize)
R155  value NP  [SMD RES 0603]  (hidden comment: Rsize)
R156  value NP  [SMD RES 0603]  (hidden comment: Rsize)
R157  value 10k  [SMD RES 0603]  (hidden comment: Rsize)
R158  value NP  [SMD RES 0603]  (hidden comment: Rsize)
R159  value 120k, 1%  [SMD RES 0603]  (hidden comment: Rsize)
R160  value 50R  [SMD RES 0603]  (hidden comment: Rsize)
R161  value 50R  [SMD RES 0603]  (hidden comment: Rsize)
R162  value 50R  [SMD RES 0603]  (hidden comment: Rsize)
R163  value 50R  [SMD RES 0603]  (hidden comment: Rsize)
R164  value 50R  [SMD RES 0603]  (hidden comment: Rsize)
R165  value 50R  [SMD RES 0603]  (hidden comment: Rsize)
R166  value 50R  [SMD RES 0603]  (hidden comment: Rsize)
R167  value 50R  [SMD RES 0603]  (hidden comment: Rsize)
R168  value 50R  [SMD RES 0603]  (hidden comment: Rsize)
R169  value 180R  [SMD RES 0603]  (hidden comment: Rsize)
R170  value 1k  [SMD RES 0603]  (hidden comment: Rsize)
R171  value 50R  [SMD RES 0603]  (hidden comment: Rsize)
R172  value 50R  [SMD RES 0603]  (hidden comment: Rsize)
R173  value 50R  [SMD RES 0603]  (hidden comment: Rsize)
R174  value 50R  [SMD RES 0603]  (hidden comment: Rsize)
R175  value 50R  [SMD RES 0603]  (hidden comment: Rsize)
R176  value 50R  [SMD RES 0603]  (hidden comment: Rsize)
R177  value 50R  [SMD RES 0603]  (hidden comment: Rsize)
R178  value 50R  [SMD RES 0603]  (hidden comment: Rsize)
R179  value 50R  [SMD RES 0603]  (hidden comment: Rsize)
R180  value 50R  [SMD RES 0603]  (hidden comment: Rsize)
R181  value 50R  [SMD RES 0603]  (hidden comment: Rsize)
R182  value 50R  [SMD RES 0603]  (hidden comment: Rsize)
R183  value 50R  [SMD RES 0603]  (hidden comment: Rsize)
R184  value 50R  [SMD RES 0603]  (hidden comment: Rsize)
R185  value 50R  [SMD RES 0603]  (hidden comment: Rsize)
R186  value 50R  [SMD RES 0603]  (hidden comment: Rsize)
R187  value 50R  [SMD RES 0603]  (hidden comment: Rsize)
R188  value 50R  [SMD RES 0603]  (hidden comment: Rsize)
R189  value 50R  [SMD RES 0603]  (hidden comment: Rsize)
R190  value 50R  [SMD RES 0603]  (hidden comment: Rsize)
R191  value 50R  [SMD RES 0603]  (hidden comment: Rsize)
R192  value 50R  [SMD RES 0603]  (hidden comment: Rsize)
R193  value 50R  [SMD RES 0603]  (hidden comment: Rsize)
R194  value 50R  [SMD RES 0603]  (hidden comment: Rsize)
R195  value 50R  [SMD RES 0603]  (hidden comment: Rsize)
R196  value 50R  [SMD RES 0603]  (hidden comment: Rsize)
R197  value 50R  [SMD RES 0603]  (hidden comment: Rsize)
R198  value 50R  [SMD RES 0603]  (hidden comment: Rsize)
R199  value 50R  [SMD RES 0603]  (hidden comment: Rsize)
R200  value 50R  [SMD RES 0603]  (hidden comment: Rsize)
R201  value 50R  [SMD RES 0603]  (hidden comment: Rsize)
RECONF  value 1-1825910-4  [1-1825910-4 Button Vert]  (hidden comment: Button TYCO 1-1825910-4)
RESET  value 1-1825027-1  [1-1825027-1 Button]  (hidden comment: Button)
U1  F28M35H52C_RFP_1  [RFP144]  (parts A,B of 2)
U2  EP3C25E144C7  [EQFP144_N]  (parts A,B,C,D,E,F,G,H,I,J,K,L,M of 13)
U3  LAN8710AI  [32M1-A_N]
U5  EPCS64SI16N  [SOIC16_M]
U6  LM3674MF-ADJ  [MF05A_N]
U7  value AT25DF321A  [SOIC127P800X216-8N]  (hidden comment: AT25DF321A serial flash)
U13  MC33161D  [751-05_N]
U14  MC33161D  [751-05_N]
U15  MC33161D  [751-05_N]
UR1  value 2.5V  [SOT95P237X120-3N]  (hidden comment: Reference voltage regulator)
UR2  value 1.25V  [SOT95P237X120-3N]  (hidden comment: Reference voltage regulator)
X1  TI 20pin JTAG  [MHDR2X10 - 2]
X2  Header 5X2  [HDR2X5 NoOverlay]
X3  Connector TE 64 pos  value 51205XX-1  [5120521-1 FEM]
X4  Connector TE 64 pos  value 51205XX-1  [5120521-1 FEM]
X5  Connector TE 64 pos  value 51205XX-1  [5120521-1 FEM]
XT1  value KXO-V97, 50MHz  [KXO-V97]  (hidden comment: Crystal generator KXO-V97)
XT2  value KXO-V97, 20MHz  [KXO-V97]  (hidden comment: Crystal generator KXO-V97)
XTAL1  value KX-7 25MHz  [KX-7 XTAL]  (hidden comment: KX-7)
XTAL2  value KX-7 20MHz  [KX-7 XTAL]  (hidden comment: KX-7)

## Nets
ADCREF: C67.2 UR2.2(OUT) X5.32
AGND: C29.1 C30.1 C31.1 C32.1 C45.2 C65.2 C66.2 C67.1 C186.1 C188.1 R10.2 R22.2 R23.2 U1.118(VSSA1) U1.135(VSSA2) UR1.3(GND) UR2.3(GND) X5.33 X5.34 X5.35 X5.36 X5.37 X5.38 X5.39 X5.40 X5.41 X5.42 X5.43 X5.44 X5.45 X5.46 X5.47 X5.48 X5.49 X5.50 X5.51 X5.52 X5.53 X5.54 X5.55 X5.56 X5.57 X5.58
DGND: C1.2 C2.2 C3.2 C4.2 C5.2 C6.2 C7.2 C8.2 C9.2 C10.2 C11.2 C12.1 C13.1 C14.1 C15.1 C16.1 C17.2 C18.2 C19.2 C20.2 C21.1 C22.1 C23.1 C24.1 C25.1 C26.1 C27.1 C28.1 C33.1 C34.1 C35.1 C36.1 C37.1 C38.1 C39.1 C40.1 C41.2 C42.1 C43.1 C44.1 C68.1 C69.1 C70.1 C71.1 C72.2 C73.1 C74.1 C75.2 C76.1 C80.1 C81.1 C82.1 C83.1 C84.1 C85.1 C86.1 C87.1 C88.1 C89.2 C91.2 C92.1 C93.1 C94.2 C95.2 C96.1 C97.1 C98.1 C99.1 C100.1 C101.1 C102.1 C103.1 C104.1 C107.1 C110.1 C111.2 C112.2 C113.1 C114.1 C115.1 C116.1 C117.1 C120.1 C121.1 C123.1 C124.1 C126.1 C127.1 C128.1 C129.2 C130.2 C131.1 C132.1 C133.2 C134.2 C135.2 C136.2 C137.1 C138.1 C139.1 C140.1 C141.1 C142.1 C143.1 C144.1 C169.1 C170.1 C171.1 C172.1 C173.1 C177.2 C178.2 C179.2 C180.2 C181.2 C185.1 C225.1 C226.1 C227.1 D14.0(PAD_(AGND)) D14.6(AGND) D14.14(PGND) D14.15(PGND) D19.3(GND) D20.3(GND) D21.3(GND) D22.3(GND) D23.3(GND) ISO1.2(GND1) ISO1.8(GND1) ISO2.9(GND2) ISO2.15(GND2) ISO3.2(GND1) ISO3.8(GND1) ISO4.9(GND2) ISO4.15(GND2) ISO5.2(GND1) ISO5.8(GND1) ISO6.9(GND2) ISO6.15(GND2) ISO7.2(GND1) ISO7.8(GND1) ISO8.9(GND2) ISO8.15(GND2) ISO9.2(GND1) ISO9.8(GND1) ISO10.9(GND2) ISO10.15(GND2) J1.8(CHS_GND3) J1.13(CHS_GND1) J1.14(CHS_GND2) LED2.1 LED5.1 Q1.2(E) R6.1 R8.2 R10.1 R18.1 R19.1 R20.1 R21.1 R22.1 R23.1 R31.1 R32.2 R38.1 R45.1 R46.1 R48.1 R49.1 R50.1 R53.2 R82.1 R85.1 R119.2 R127.2 R131.2 R133.2 R135.2 R137.2 R158.1 R159.2 RECONF.3 RECONF.4 RESET.1 U1.94(VSSOSC) U1.EPAD U2.2(GNDA3) U2.19(GND) U2.21(nCE) U2.27(GND) U2.36(GNDA1) U2.41(GND) U2.48(GND) U2.57(GND) U2.63(GND) U2.74(GNDA4) U2.82(GND) U2.94(MSEL0) U2.95(GND) U2.97(MSEL2) U2.108(GNDA2) U2.118(GND) U2.123(GND) U2.131(GND) U2.140(GND) U2.145(Ground_Plane) U3.33(GND1) U5.10(GND) U6.2(GND) U7.4(GND) U13.4(GND) U14.4(GND) U15.4(GND) X1.4(TDIS) X1.8(GND) X1.10(GND) X1.12(GND) X1.16(GND) X1.20(GND) X2.2 X2.10 X4.62 X4.63 X4.64 X5.59 X5.60 X5.61 X5.62 X5.63 X5.64 XT1.2(GND) XT2.2(GND) XTAL1.2(G) XTAL1.4(G) XTAL2.2(G) XTAL2.4(G)  [also labelled GND]
ENET_VDDA: C35.2 C36.2 C37.2 C38.2 L8.2 R27.2 R28.2 R29.2 R30.2 R47.2 U3.1(VDD2A) U3.27(VDD1A)
ENET_VDDCR: C39.2 C40.2 U3.6(VDDCR)
ENET_VDDIO: C33.2 C34.2 L9.2 R15.2 R16.2 R17.2 U3.12(VDDIO)
EXT_GND: C77.2 C78.1 C79.2 C148.1 C154.1 C155.1 C156.1 C157.1 C161.2 C162.2 C163.2 C164.2 C165.2 ISO1.9(GND2) ISO1.15(GND2) ISO2.2(GND1) ISO2.8(GND1) ISO3.9(GND2) ISO3.15(GND2) ISO4.2(GND1) ISO4.8(GND1) ISO5.9(GND2) ISO5.15(GND2) ISO6.2(GND1) ISO6.8(GND1) ISO7.9(GND2) ISO7.15(GND2) ISO8.2(GND1) ISO8.8(GND1) ISO9.9(GND2) ISO9.15(GND2) ISO10.2(GND1) ISO10.8(GND1) R87.1 R155.1 X3.3 X3.6 X3.9 X3.12 X3.15 X3.18 X3.21 X3.24 X3.27 X3.33 X3.34 X3.35 X3.36 X3.37 X3.38 X3.39 X3.40 X3.41 X3.42 X3.43 X3.44 X3.45 X3.46 X3.47 X3.48 X3.49 X3.50 X3.51 X3.52 X3.53 X3.54 X3.55 X3.56 X3.57 X3.58 X3.59 X3.60 X3.61 X3.62 X3.63 X3.64 X4.6 X4.9 X4.12 X4.15 X4.18 X4.21 X4.24 X4.27 X4.30 X4.33 X4.34 X4.35 X4.36 X4.37 X4.38 X4.39 X4.40 X4.41 X4.42 X4.43 X4.44 X4.45 X4.46 X4.47 X4.48 X4.49 X4.50 X4.51 X4.52 X4.53 X4.54 X4.55 X4.56 X4.57 X4.58 X4.59 X4.60 X4.61
VCC5V: C77.1 C78.2 C148.2 C154.2 C155.2 C156.2 C157.2 C161.1 C162.1 C163.1 C164.1 C165.1 ISO1.16(VDD2) ISO2.1(VDD1) ISO3.16(VDD2) ISO4.1(VDD1) ISO5.16(VDD2) ISO6.1(VDD1) ISO7.16(VDD2) ISO8.1(VDD1) ISO9.16(VDD2) ISO10.1(VDD1) R152.2 R156.2 X3.31 X3.32
VCCAPLL: C86.2 C87.2 C88.2 C92.2 C117.2 C121.2 L25.2 U2.3(VCCA3) U2.35(VCCA1) U2.75(VCCA4) U2.96(MSEL1) U2.107(VCCA2)
VCCINT_FPGA: C72.1 C80.2 C81.2 C82.2 C83.2 C84.2 C85.2 C89.1 C98.2 C100.2 C101.2 L36.2 U2.1(VCCD_PLL3) U2.5(VCCINT) U2.29(VCCINT) U2.34(VCCINT) U2.37(VCCD_PLL1) U2.38(VCCINT) U2.45(VCCINT) U2.61(VCCINT) U2.70(VCCINT) U2.73(VCCD_PLL4) U2.78(VCCINT) U2.84(VCCINT) U2.102(VCCINT) U2.109(VCCD_PLL2) U2.116(VCCINT) U2.124(VCCINT) U2.134(VCCINT) U2.138(VCCINT)
VCCIO1: C45.1 C65.1 C66.1 C68.2 C69.2 C70.2 C71.2 C73.2 C76.2 C91.1 C93.2 C94.1 C95.1 C96.2 C97.2 C99.2 C102.2 C103.2 C104.2 C107.2 C110.2 C111.1 C112.1 C113.2 C115.2 C116.2 C123.2 C126.2 C129.1 C130.1 C133.1 C134.1 C135.1 C136.1 C137.2 C138.2 C139.2 C140.2 C141.2 C142.2 C143.2 C144.2 C169.2 C170.2 C171.2 C172.2 C173.2 C177.1 C178.1 C179.1 C180.1 C181.1 C186.2 C225.2 C226.2 C227.2 D14.3(FREQ) D14.10(AVIN) D14.11(PVIN) D14.12(PVIN) D14.13(EN) D19.5(Vcc) D20.5(Vcc) D21.5(Vcc) D22.5(Vcc) D23.5(Vcc) ISO1.1(VDD1) ISO2.10(VE2) ISO2.16(VDD2) ISO3.1(VDD1) ISO4.10(VE2) ISO4.16(VDD2) ISO5.1(VDD1) ISO6.10(VE2) ISO6.16(VDD2) ISO7.1(VDD1) ISO8.10(VE2) ISO8.16(VDD2) ISO9.1(VDD1) ISO10.10(VE2) ISO10.16(VDD2) L1.2 L2.1 L3.1 L4.2 L5.2 L6.2 L8.1 L9.1 L10.2 L11.2 L12.2 L13.2 L14.2 L15.2 L16.2 L17.2 L18.2 L19.2 L20.2 L21.2 L22.2 LED12.2 LED13.2 LED14.2 LED15.2 LED16.2 R33.1 R34.1 R37.1 R41.2 R42.2 R43.2 R44.2 R52.2 R55.1 R56.1 R64.2 R77.2 R78.2 R96.1 R117.1 R130.1 R132.1 R134.1 R136.1 R150.2 R157.2 R169.1 U2.17(VCCIO1) U2.26(VCCIO2) U2.40(VCCIO3) U2.47(VCCIO3) U2.56(VCCIO4) U2.62(VCCIO4) U2.81(VCCIO5) U2.93(VCCIO6) U2.117(VCCIO7) U2.122(VCCIO7) U2.130(VCCIO8) U2.139(VCCIO8) U5.1(VCC) U5.2(VCC) U5.9(VCC) U6.1(VIN) U6.3(EN) U7.3(nWP) U7.7(nHOLD) U7.8(VCC) U13.8(VCC) U14.8(VCC) U15.8(VCC) UR1.1(IN) UR2.1(IN) X1.5(PD) X2.4 X4.1 X4.2 X4.3 X5.3 X5.6 XT1.1(EN) XT1.4(VCC) XT2.1(EN) XT2.4(VCC)  [also labelled VCCIO2, VCCIO3, VCCIO4, VCCIO5, VCCIO6, VCCIO7, VCCIO8, VDD3V3]
VDD1V2: C114.2 C127.2 D14.16(VOS) L35.2 L36.1 R83.2 R84.2 R122.2 R123.1 R170.1
VDD2V5: C120.2 C122.2 C124.2 L25.1 L26.2 R81.2 R99.1 R125.1
VREF2V5: C29.2 C31.2 C188.2 U1.120(ADC1VREFHI) U1.133(ADC2VREFHI) UR1.2(OUT) X5.31
1V2_OK: R157.1 R158.2 U2.52(CLK15,_DIFFCLK_6p) U13.5(OUT2) U13.6(OUT1) U14.5(OUT2) U14.6(OUT1) U15.5(OUT2) U15.6(OUT1)  [also labelled 2V5_OK, 3V3_OK, PGOOD_INTERNAL]
12MHz: U2.22(CLK0,_DIFFCLK_0p) XT2.3(OUT)
50MHz: U2.23(CLK1,_DIFFCLK_0n) XT1.3(OUT)
ADC1INA0: U1.121(ADC1INA0) X5.11
ADC1INA2: U1.122(ADC1INA2) X5.12
ADC1INA3: U1.123(ADC1INA3) X5.13
ADC1INA4: U1.124(ADC1INA4) X5.14
ADC1INA6: U1.125(ADC1INA6) X5.15
ADC1INA7: U1.126(ADC1INA7) X5.16
ADC1INB0: U1.117(ADC1INB0) X5.10
ADC1INB3: U1.116(ADC1INB3) X5.9
ADC1INB4: U1.115(ADC1INB4) X5.8
ADC1INB7: U1.114(ADC1INB7) X5.7
ADC2INA0: U1.132(ADC2INA0) X5.22
ADC2INA2: U1.131(ADC2INA2) X5.21
ADC2INA3: U1.130(ADC2INA3) X5.20
ADC2INA4: U1.129(ADC2INA4) X5.19
ADC2INA6: U1.128(ADC2INA6) X5.18
ADC2INA7: U1.127(ADC2INA7) X5.17
ADC2INB0: U1.136(ADC2INB0) X5.23
ADC2INB3: U1.137(ADC2INB3) X5.24
ADC2INB4: U1.138(ADC2INB4) X5.25
ADC2INB7: U1.139(ADC2INB7) X5.26
ALE_EPI0S30: U1.53(PJ6_GPIO62) U2.44(IO,_PLL1_CLKOUTn)
CAN0Rx: U1.9(PA4_GPIO4) X5.5
CAN0Tx: U1.12(PA5_GPIO5) X5.4
CAN1Rx: U1.31(PB5_GPIO13) X5.2
CAN1Tx: U1.30(PB4_GPIO12) X5.1
COMP1OUT: U1.141(GPIO129/COMP1OUT)
COMP2OUT: U1.143(GPIO131/COMP2OUT)
COMP3OUT: U1.112(GPIO132/COMP3OUT)
COMP4OUT: U1.111(GPIO133/COMP4OUT)
COMP5OUT: U1.109(GPIO135/COMP5OUT)
COMP6OUT: U1.142(GPIO130/COMP6OUT)
CPU_INOUT3: U1.13(PA6_GPIO6) U2.7(IO,_VREFB1N0)
CPU_INOUT4: U1.14(PA7_GPIO7) U2.80(IO,_VREFB5N0)
CPU_OUT1: U1.5(PA0_GPIO0) U2.25(CLK3,_DIFFCLK_1n)
CPU_OUT2: U1.6(PA1_GPIO1) U2.53(CLK14,_DIFFCLK_6n)
CPU_OUT3: U1.7(PA2_GPIO2) U2.54(CLK13,_DIFFCLK_7p)
CPU_OUT4: U1.8(PA3_GPIO3) U2.55(CLK12,_DIFFCLK_7n)
CPU_RESET: C28.2 C131.2 R52.1 R54.2 R88.1 RESET.2 U1.4(*XRS) U1.144(*ARS)
CPUJTAG_EMU0: R55.2 U1.83(EMU0) X1.13(EMU0)
CPUJTAG_EMU1: R56.2 U1.86(EMU1) X1.14(EMU1)
CPUJTAG_nTRST: R53.1 U1.85(*TRST) X1.2(nTRST)
CPUJTAG_TCK: U1.89(TCK) X1.9(RTCK) X1.11(TCK)
CPUJTAG_TDI: U1.88(TDI) X1.3(TDI)
CPUJTAG_TDO: U1.84(TDO) X1.7(TDO)
CPUJTAG_TMS: U1.87(TMS) X1.1(TMS)
DA0_EPI0S0: U1.35(PH3_GPIO51) U2.76(IO,_RUP3)
DA1_EPI0S1: U1.36(PH2_GPIO50) U2.72(IO,_PLL4_CLKOUTn)
DA2_EPI0S2: U1.37(PC4_GPIO68) U2.71(IO,_PLL4_CLKOUTp)
DA3_EPI0S3: U1.38(PC5_GPIO69) U2.69(IO)
DA4_EPI0S4: U1.39(PC6_GPIO70) U2.68(IO,_(DQS0B/CQ1B,CDPCLK3))
DA5_EPI0S5: U1.40(PC7_GPIO71) U2.67(IO,_RDN2,_(DQ1B))
DA6_EPI0S6: U1.41(PH0_GPIO48) U2.66(IO,_RUP2,_(DQ1B))
DA7_EPI0S7: U1.42(PH1_GPIO49) U2.65(IO,_VREFB4N0)
DA8_EPI0S8: U1.43(PE0_GPIO24) U2.64(IO)
DA9_EPI0S9: U1.45(PE1_GPIO25) U2.60(IO,_DIFFIO_B17n,_(DQ1B))
DA10_EPI0S10: U1.46(PH4_GPIO52) U2.59(IO,_DIFFIO_B17p,_(DQ1B))
DA11_EPI0S11: U1.47(PH5_GPIO53) U2.58(IO,_(DQ1B))
DA12_EPI0S12: U1.48(PF4_GPIO36) U2.51(IO,_(DQ1B))
DA13_EPI0S13: U1.49(PG0_PGIO40) U2.50(IO,_(DQ1B))
DA14_EPI0S14: U1.50(PG1_GPIO41) U2.49(IO,_(DQ1B))
DA15_EPI0S15: U1.51(PF5_GPIO37) U2.46(IO,_VREFB3N0)
DA16_EPI0S16: U1.63(PJ0_GPIO56) U2.31(IO,_VREFB2N0)
DA17_EPI0S17: U1.62(PJ1_GPIO57) U2.32(IO,_RUP1)
DA18_EPI0S18: U1.61(PJ2_GPIO58) U2.33(IO,_RDN1)
DA19_EPI0S19: U1.60(PJ3_GPIO59) U2.39(IO)
ENETRX_N: J1.6(RX-) R30.1 U3.30(RX-)
ENETRX_P: J1.3(RX+) R29.1 U3.31(RX+)
ENETTX_N: J1.2(TX-) R28.1 U3.28(TX-)
ENETTX_P: J1.1(TX+) R27.1 U3.29(TX+)
EPWM5A: D20.2(A) U1.15(PB0_GPIO8)  [also labelled FPGA_LED1]
EPWM5B: D21.2(A) U1.18(PB1_GPIO9)  [also labelled FPGA_LED2]
EPWM6A: D19.2(A) U1.19(PB2_GPIO10)  [also labelled FPGA_LED3]
EPWM6B: D22.2(A) U1.20(PB3_GPIO11)  [also labelled FPGA_LED4]
FPGA_INPUT1: R167.1 U2.83(IO)
FPGA_INPUT2: R165.1 U2.85(IO,_(DQS1R/CQ1R#,DPCLK6))
FPGA_INPUT3: R163.1 U2.86(IO,_DIFFIO_R9n,_(DEV_OE))
FPGA_INPUT4: R161.1 U2.87(IO,_DIFFIO_R9p,_(DEV_CLRn))
FPGA_INPUT5: R177.1 U2.88(CLK7,_DIFFCLK_3n)
FPGA_INPUT6: R175.1 U2.89(CLK6,_DIFFCLK_3p)
FPGA_INPUT7: R173.1 U2.90(CLK5,_DIFFCLK_2n)
FPGA_INPUT8: R171.1 U2.91(CLK4,_DIFFCLK_2p)
FPGA_INPUT9: R185.1 U2.110(IO,_(DQS0T/CQ1T,CDPCLK6))
FPGA_INPUT10: R183.1 U2.111(IO)
FPGA_INPUT11: R181.1 U2.112(IO,_PLL2_CLKOUTn)
FPGA_INPUT12: R179.1 U2.113(IO,_PLL2_CLKOUTp)
FPGA_INPUT13: R193.1 U2.126(CLK8,_DIFFCLK_5n)
FPGA_INPUT14: R191.1 U2.127(CLK9,_DIFFCLK_5p)
FPGA_INPUT15: R189.1 U2.128(CLK10,_DIFFCLK_4n)
FPGA_INPUT16: R187.1 U2.129(CLK11,_DIFFCLK_4p)
FPGA_INPUT17: R201.1 U2.132(IO,_DIFFIO_T10n,_(DATA2),_(DQ1T))
FPGA_INPUT18: R199.1 U2.133(IO,_DIFFIO_T10p,_(DATA3),_(DQ1T))
FPGA_INPUT19: R197.1 U2.135(IO,_(DATA4),_(DQ1T))
FPGA_INPUT20: R195.1 U2.136(IO,_VREFB8N0)
FPGA_OUTPUT1: R79.2 U2.98(IO,_DIFFIO_R5n,_(INIT_DONE))
FPGA_OUTPUT2: R14.2 U2.99(IO,_DIFFIO_R5p,_(CRC_ERROR))
FPGA_OUTPUT3: R12.2 U2.100(IO)
FPGA_OUTPUT4: R3.2 U2.101(IO,_DIFFIO_R4n,_(nCEO))
FPGA_OUTPUT5: R95.2 U2.103(IO,_DIFFIO_R4p,_(CLKUSR))
FPGA_OUTPUT6: R93.2 U2.104(IO,_(DQS0R/CQ1R,DPCLK7))
FPGA_OUTPUT7: R91.2 U2.105(IO,_VREFB6N0)
FPGA_OUTPUT8: R89.2 U2.106(IO,_(PADD20))
FPGA_OUTPUT9: R105.2 U2.114(IO,_RUP4,_(DQ1T))
FPGA_OUTPUT10: R103.2 U2.115(IO,_RDN4,_(DQ1T))
FPGA_OUTPUT11: R101.2 U2.119(IO,_VREFB7N0)
FPGA_OUTPUT12: R98.2 U2.120(IO,_(PADD1),_(DQ1T))
FPGA_OUTPUT13: R114.2 U2.121(IO,_(PADD4))
FPGA_OUTPUT14: R111.2 U2.125(IO,_(PADD12))
FPGA_OUTPUT15: R109.2 U2.137(IO,_(DATA5),_(DQ1T))
FPGA_OUTPUT16: R107.2 U2.141(IO)
FPGA_OUTPUT17: R153.2 U2.142(IO,_(DATA12),_(DQS1T/CQ1T#,CDPCLK7))
FPGA_OUTPUT18: R141.2 U2.143(IO,_PLL3_CLKOUTn,_(DQ1T))
FPGA_OUTPUT19: R139.2 U2.144(IO,_PLL3_CLKOUTp,_(DM1T))
FPGA_OUTPUT20: R129.2 U2.4(IO)
FPGA_RESET: C185.2 R88.2 U2.24(CLK2,_DIFFCLK_1p)
GPIO47/CPU_BOOT_1: R134.2 R135.1 U1.52(PG7_GPIO47)
GPIO128: U1.140(GPIO128)
GPIO134: U1.110(GPIO134)
INPUT1: R166.2 X4.5
INPUT2: R164.2 X4.8
INPUT3: R162.2 X4.11
INPUT4: R160.2 X4.14
INPUT5: R176.2 X4.17
INPUT6: R174.2 X4.20
INPUT7: R172.2 X4.23
INPUT8: R168.2 X4.26
INPUT9: R184.2 X4.29
INPUT10: R182.2 X4.32
INPUT11: R180.2 X3.2
INPUT12: R178.2 X3.5
INPUT13: R192.2 X3.8
INPUT14: R190.2 X3.11
INPUT15: R188.2 X3.14
INPUT16: R186.2 X3.17
INPUT17: R200.2 X3.20
INPUT18: R198.2 X3.23
INPUT19: R196.2 X3.26
INPUT20: R194.2 X3.29
JTAG_TCK: U2.16(TCK) X2.1
JTAG_TDI: U2.15(TDI) X2.9
JTAG_TDO: U2.20(TDO) X2.3
JTAG_TMS: U2.18(TMS) X2.5
MII_COL: R17.1 R63.1 U1.71(PG2_GPIO42)
MII_CRS: R62.1 U1.26(PB6_GPIO14)
MII_MDC/BOOT_2: R34.2 R132.2 R133.1 U1.81(PF3_GPIO35) U3.17(MDC)
MII_MDIO: R33.2 U1.22(PE6_GPIO30) U3.16(MDIO)
MII_PHYINTRn/BOOT_3: R35.1 R130.2 R131.1 U1.82(PF2_GPIO34)
MII_PHYRSTn: R37.2 U1.97(PJ7_GPIO17) U3.19(RESETn)
MII_RXCK: R19.2 R25.1 U1.104(PF0_GPIO32)
MII_RXD0: R15.1 R60.1 U1.77(PE4_GPIO28)
MII_RXD1: R16.1 R59.1 U1.27(PB7_GPIO15)
MII_RXD2: R21.2 R58.1 U1.69(PF6_GPIO38)
MII_RXD3: R20.2 R26.1 U1.23(PE7_GPIO31)
MII_RXDV/BOOT0: R40.1 R136.2 R137.1 U1.78(PG3_GPIO43)
MII_RXER: R18.2 R61.1 U1.103(PF1_GPIO33)
MII_TXCK: R39.1 U1.70(PG6_GPIO46)
MII_TXD0: U1.68(PD7_GPIO23) U3.22(TXD0)
MII_TXD1: U1.73(PD6_GPIO22) U3.23(TXD1)
MII_TXD2: U1.64(PD5_GPIO21) U3.24(TXD2)
MII_TXD3: U1.65(PD4_GPIO20) U3.25(TXD3)
MII_TXEN: U1.72(PG5_GPIO45) U3.21(TX_EN)
MII_TXER: R36.1 R38.2 U1.76(PE5_GPIO29)
MOEn_EPI0S28: U1.57(PJ4_GPIO60) U2.42(IO,_(DQS1B/CQ1B#,CDPCLK2))
MWEn_EPI0S29: U1.56(PJ5_GPIO61) U2.43(IO,_PLL1_CLKOUTp)
nBHEn_EPI0S0: U1.33(PE3_GPIO27) U2.77(IO,_RDN3)
nBLEn_EPI0S0: U1.32(PE2_GPIO26) U2.79(IO)
nCS0_EPI0S26: U1.79(PH6_GPIO54) U2.28(IO)
nCS1_EPI0S27: U1.80(PH7_GPIO55) U2.30(IO,_(DQS1L/CQ1L#,DPCLK1))
OUTENA: C79.1 ISO1.10(VE2) ISO3.10(VE2) ISO5.10(VE2) ISO7.10(VE2) R87.2 R156.1 X3.30
OUTPUT1: R86.1 X4.4
OUTPUT2: R76.1 X4.7
OUTPUT3: R13.1 X4.10
OUTPUT4: R11.1 X4.13
OUTPUT5: R97.1 X4.16
OUTPUT6: R94.1 X4.19
OUTPUT7: R92.1 X4.22
OUTPUT8: R90.1 X4.25
OUTPUT9: R106.1 X4.28
OUTPUT10: R104.1 X4.31
OUTPUT11: R102.1 X3.1
OUTPUT12: R100.1 X3.4
OUTPUT13: R115.1 X3.7
OUTPUT14: R112.1 X3.10
OUTPUT15: R110.1 X3.13
OUTPUT16: R108.1 X3.16
OUTPUT17: R154.1 X3.19
OUTPUT18: R151.1 X3.22
OUTPUT19: R140.1 X3.25
OUTPUT20: R138.1 X3.28
PRG_ASDO: U2.6(IO,_(DATA1,_ASDO)) U5.15(ASDI)
PRG_CONF_DONE: D23.2(A) R150.1 U2.92(CONF_DONE)
PRG_DATA0: R80.2 U2.13(IO,_(DATA0))
PRG_DCLK: U2.12(DCLK) U5.16(DCLK)
PRG_nCONFIG: C132.2 R78.1 RECONF.1 U2.14(nCONFIG)
PRG_nCSO: U2.8(IO,_(FLASH_nCE,_nCSO)) U5.7(nCS)
PRG_nSTATUS: R77.1 U2.9(nSTATUS)
SPICLK/SSI0CLK: U1.28(PD2_GPIO18) U7.6(SCK)
SPISIMO/SSI0TX: U1.102(PD0_GPIO16) U7.5(SI(SIO))
SPISOMI/SSI0RX: U1.98(PD1_GPIO17) U7.2(SO(SOI))
SPISTEA/SSI0FSS: R64.1 U1.29(PD3_GPIO19) U7.1(nCS)
NetC1_1: C1.1 U1.1(VDD18)
NetC2_1: C2.1 L10.1 U1.2(VDDIO)
NetC3_1: C3.1 L4.1 U1.3(VDDIO)
NetC4_1: C4.1 L12.1 U1.10(VDDIO)
NetC5_1: C5.1 U1.11(VDD12)
NetC6_1: C6.1 L13.1 U1.17(VDDIO)
NetC7_1: C7.1 L11.1 U1.67(VDDIO)
NetC8_1: C8.1 U1.66(VDD12)
NetC9_1: C9.1 L14.1 U1.59(VDDIO)
NetC10_1: C10.1 U1.58(VDD12)
NetC11_1: C11.1 U1.55(VDD12)
NetC12_2: C12.2 L18.1 U1.34(VDDIO)
NetC13_2: C13.2 L16.1 U1.25(VDDIO)
NetC14_2: C14.2 U1.24(VDD12)
NetC15_2: C15.2 L17.1 U1.44(VDDIO)
NetC16_2: C16.2 L15.1 U1.54(VDDIO)
NetC17_1: C17.1 L1.1 U1.74(VDDIO)
NetC18_1: C18.1 U1.75(VDD12)
NetC19_1: C19.1 U1.90(VDD12)
NetC20_1: C20.1 L19.1 U1.92(VDDIO)
NetC21_2: C21.2 L20.1 U1.96(VDDIO)
NetC22_2: C22.2 U1.99(VDD12)
NetC23_2: C23.2 L21.1 U1.100(VDDIO)
NetC24_2: C24.2 L22.1 U1.105(VDDIO)
NetC25_2: C25.2 L5.1 U1.106(VDDIO)
NetC26_2: C26.2 L6.1 U1.107(VDDIO)
NetC27_2: C27.2 U1.108(VDD18)
NetC30_2: C30.2 L3.2 U1.119(VDDA1)
NetC32_2: C32.2 L2.2 U1.134(VDDA2)
NetC41_1: C41.1 U3.5(XTAL1) XTAL1.3(X)
NetC42_2: C42.2 U3.4(XTAL2) XTAL1.1(X1)
NetC43_2: C43.2 J1.5(RXCT) R41.1 R43.1 R45.2
NetC44_2: C44.2 J1.4(TXCT) R42.1 R44.1 R46.2
NetC74_2: C74.2 U1.93(X1) XTAL2.1(X1)
NetC75_1: C75.1 U1.95(X2) XTAL2.3(X)
NetC122_1: C122.1 R81.1 R82.2 U6.4(FB)
NetC125_1: C125.1 D14.8(CN)
NetC125_2: C125.2 D14.7(CP)
NetC128_2: C128.2 D14.9(SS)
NetD14_1: D14.1(SW) D14.2(SW) L35.1
NetD14_4: D14.4(PG) R84.1
NetD14_5: D14.5(FB) R83.1 R85.2
NetD19_4: D19.4(Y) R142.1
NetD20_4: D20.4(Y) R143.1
NetD21_4: D21.4(Y) R144.1
NetD22_4: D22.4(Y) R145.1
NetD23_4: D23.4(Y) R146.1
NetISO1_3: ISO1.3(IN1) R3.1
NetISO1_4: ISO1.4(IN2) R12.1
NetISO1_5: ISO1.5(IN3) R14.1
NetISO1_6: ISO1.6(IN4) R79.1
NetISO1_11: ISO1.11(OUT4) R86.2
NetISO1_12: ISO1.12(OUT3) R76.2
NetISO1_13: ISO1.13(OUT2) R13.2
NetISO1_14: ISO1.14(OUT1) R11.2
NetISO2_3: ISO2.3(IN1) R160.1
NetISO2_4: ISO2.4(IN2) R162.1
NetISO2_5: ISO2.5(IN3) R164.1
NetISO2_6: ISO2.6(IN4) R166.1
NetISO2_11: ISO2.11(OUT4) R167.2
NetISO2_12: ISO2.12(OUT3) R165.2
NetISO2_13: ISO2.13(OUT2) R163.2
NetISO2_14: ISO2.14(OUT1) R161.2
NetISO3_3: ISO3.3(IN1) R89.1
NetISO3_4: ISO3.4(IN2) R91.1
NetISO3_5: ISO3.5(IN3) R93.1
NetISO3_6: ISO3.6(IN4) R95.1
NetISO3_11: ISO3.11(OUT4) R97.2
NetISO3_12: ISO3.12(OUT3) R94.2
NetISO3_13: ISO3.13(OUT2) R92.2
NetISO3_14: ISO3.14(OUT1) R90.2
NetISO4_3: ISO4.3(IN1) R168.1
NetISO4_4: ISO4.4(IN2) R172.1
NetISO4_5: ISO4.5(IN3) R174.1
NetISO4_6: ISO4.6(IN4) R176.1
NetISO4_11: ISO4.11(OUT4) R177.2
NetISO4_12: ISO4.12(OUT3) R175.2
NetISO4_13: ISO4.13(OUT2) R173.2
NetISO4_14: ISO4.14(OUT1) R171.2
NetISO5_3: ISO5.3(IN1) R98.1
NetISO5_4: ISO5.4(IN2) R101.1
NetISO5_5: ISO5.5(IN3) R103.1
NetISO5_6: ISO5.6(IN4) R105.1
NetISO5_11: ISO5.11(OUT4) R106.2
NetISO5_12: ISO5.12(OUT3) R104.2
NetISO5_13: ISO5.13(OUT2) R102.2
NetISO5_14: ISO5.14(OUT1) R100.2
NetISO6_3: ISO6.3(IN1) R178.1
NetISO6_4: ISO6.4(IN2) R180.1
NetISO6_5: ISO6.5(IN3) R182.1
NetISO6_6: ISO6.6(IN4) R184.1
NetISO6_11: ISO6.11(OUT4) R185.2
NetISO6_12: ISO6.12(OUT3) R183.2
NetISO6_13: ISO6.13(OUT2) R181.2
NetISO6_14: ISO6.14(OUT1) R179.2
NetISO7_3: ISO7.3(IN1) R107.1
NetISO7_4: ISO7.4(IN2) R109.1
NetISO7_5: ISO7.5(IN3) R111.1
NetISO7_6: ISO7.6(IN4) R114.1
NetISO7_11: ISO7.11(OUT4) R115.2
NetISO7_12: ISO7.12(OUT3) R112.2
NetISO7_13: ISO7.13(OUT2) R110.2
NetISO7_14: ISO7.14(OUT1) R108.2
NetISO8_3: ISO8.3(IN1) R186.1
NetISO8_4: ISO8.4(IN2) R188.1
NetISO8_5: ISO8.5(IN3) R190.1
NetISO8_6: ISO8.6(IN4) R192.1
NetISO8_11: ISO8.11(OUT4) R193.2
NetISO8_12: ISO8.12(OUT3) R191.2
NetISO8_13: ISO8.13(OUT2) R189.2
NetISO8_14: ISO8.14(OUT1) R187.2
NetISO9_3: ISO9.3(IN1) R129.1
NetISO9_4: ISO9.4(IN2) R139.1
NetISO9_5: ISO9.5(IN3) R141.1
NetISO9_6: ISO9.6(IN4) R153.1
NetISO9_10: ISO9.10(VE2) R152.1 R155.2
NetISO9_11: ISO9.11(OUT4) R154.2
NetISO9_12: ISO9.12(OUT3) R151.2
NetISO9_13: ISO9.13(OUT2) R140.2
NetISO9_14: ISO9.14(OUT1) R138.2
NetISO10_3: ISO10.3(IN1) R194.1
NetISO10_4: ISO10.4(IN2) R196.1
NetISO10_5: ISO10.5(IN3) R198.1
NetISO10_6: ISO10.6(IN4) R200.1
NetISO10_11: ISO10.11(OUT4) R201.2
NetISO10_12: ISO10.12(OUT3) R199.2
NetISO10_13: ISO10.13(OUT2) R197.2
NetISO10_14: ISO10.14(OUT1) R195.2
NetJ1_9: J1.9(A_GRN) R47.1 R48.2 U3.3(LED1/REGOFF)
NetJ1_10: J1.10(C_GRN) R50.2
NetJ1_11: J1.11(C_YLW) R49.2
NetJ1_12: J1.12(A_YLW) R31.2 U3.2(LED2/INTSELn)
NetL26_1: L26.1 U6.5(SW)
NetLED2_2: LED2.2 R96.2
NetLED4_1: LED4.1 Q1.3(C)
NetLED4_2: LED4.2 R169.2
NetLED5_2: LED5.2 R99.2
NetLED12_1: LED12.1 R142.2
NetLED13_1: LED13.1 R143.2
NetLED14_1: LED14.1 R144.2
NetLED15_1: LED15.1 R145.2
NetLED16_1: LED16.1 R146.2
NetQ1_1: Q1.1(B) R170.2
NetR6_2: R6.2 U1.101(*VREG12EN)
NetR8_1: R8.1 U1.113(*VREG18EN)
NetR25_2: R25.2 U3.7(RXCLK/PHYAD1)
NetR26_2: R26.2 U3.8(RXD3/PHYAD2)
NetR32_1: R32.1 U3.32(RBIAS)
NetR35_2: R35.2 R36.2 U3.18(INT/TX_ER/TXD4)
NetR39_2: R39.2 U3.20(TX_CLK)
NetR40_2: R40.2 U3.26(RX_DV)
NetR54_1: R54.1 X1.15(RESETn)
NetR58_2: R58.2 U3.9(RXD2/RMIISEL)
NetR59_2: R59.2 U3.10(RXD1/MODE1)
NetR60_2: R60.2 U3.11(RXD0/MODE0)
NetR61_2: R61.2 U3.13(RX_ER/RXD4/PHYAD0)
NetR62_2: R62.2 U3.14(CRS)
NetR63_2: R63.2 U3.15(COL/CRS_DV/MODE2)
NetR80_1: R80.1 U5.8(DATA)
NetR117_2: R117.2 R118.1 U13.2(IN1)
NetR118_2: R118.2 R119.1 U13.3(IN2)
NetR121_1: R121.1 U14.1(VREF) U14.7(MS)
NetR121_2: R121.2 R122.1 U14.2(IN1)
NetR123_2: R123.2 R159.1 U14.3(IN2)
NetR125_2: R125.2 R126.1 U15.2(IN1)
NetR126_2: R126.2 R127.1 U15.3(IN2)
NetU13_1: U13.1(VREF) U13.7(MS)
NetU15_1: U15.1(VREF) U15.7(MS)

Not connected (* = marked no-connect by the designer): D19 1; D20 1; D21 1; D22 1; D23 1; ISO1 7(NC); ISO2 7(NC); ISO3 7(NC); ISO4 7(NC); ISO5 7(NC); ISO6 7(NC); ISO7 7(NC); ISO8 7(NC); ISO9 7(NC); ISO10 7(NC); J1 7(NC); RECONF 2; U1 16(FLT1) 21(FLT2) 91(NC); U2 10(IO,_DIFFIO_L6p,_(DQS0L/CQ1L,DPCLK0)) 11(IO,_DIFFIO_L6n); U5 3(NC) 4(NC) 5(NC) 6(NC) 11(NC) 12(NC) 13(NC) 14(NC); X1 6(KEY(NP)) 17(EMU2) 18(EMU3) 19(EMU4); X2 6 7 8; X5 27 28 29 30

## Layout directives
differential pair: ENETRX_N, ENETRX_P, ENETTX_N, ENETTX_P

## Notes on the sheet
- (near R118) R2
- (near R117) R3
- (near R119) R1
- (near R121) R4
- (near R122) R3
- (near R123) R2
- (near R159) R1
- (near R126) R2
- (near R125) R3
- (near R127) R1
- (in symbol EP3C25E144C7, part A) BANK 1
- (in symbol EP3C25E144C7, part B) BANK 2
- (in symbol EP3C25E144C7, part C) BANK 3
- (in symbol EP3C25E144C7, part D) BANK 4
- (in symbol EP3C25E144C7, part E) BANK 5
- (in symbol EP3C25E144C7, part F) BANK 6
- (in symbol EP3C25E144C7, part G) BANK 7
- (in symbol EP3C25E144C7, part H) BANK 8